# EAGLE schematic FMU_V.2 (EAGLE 7.4.0)

## Sheet 1 of 10
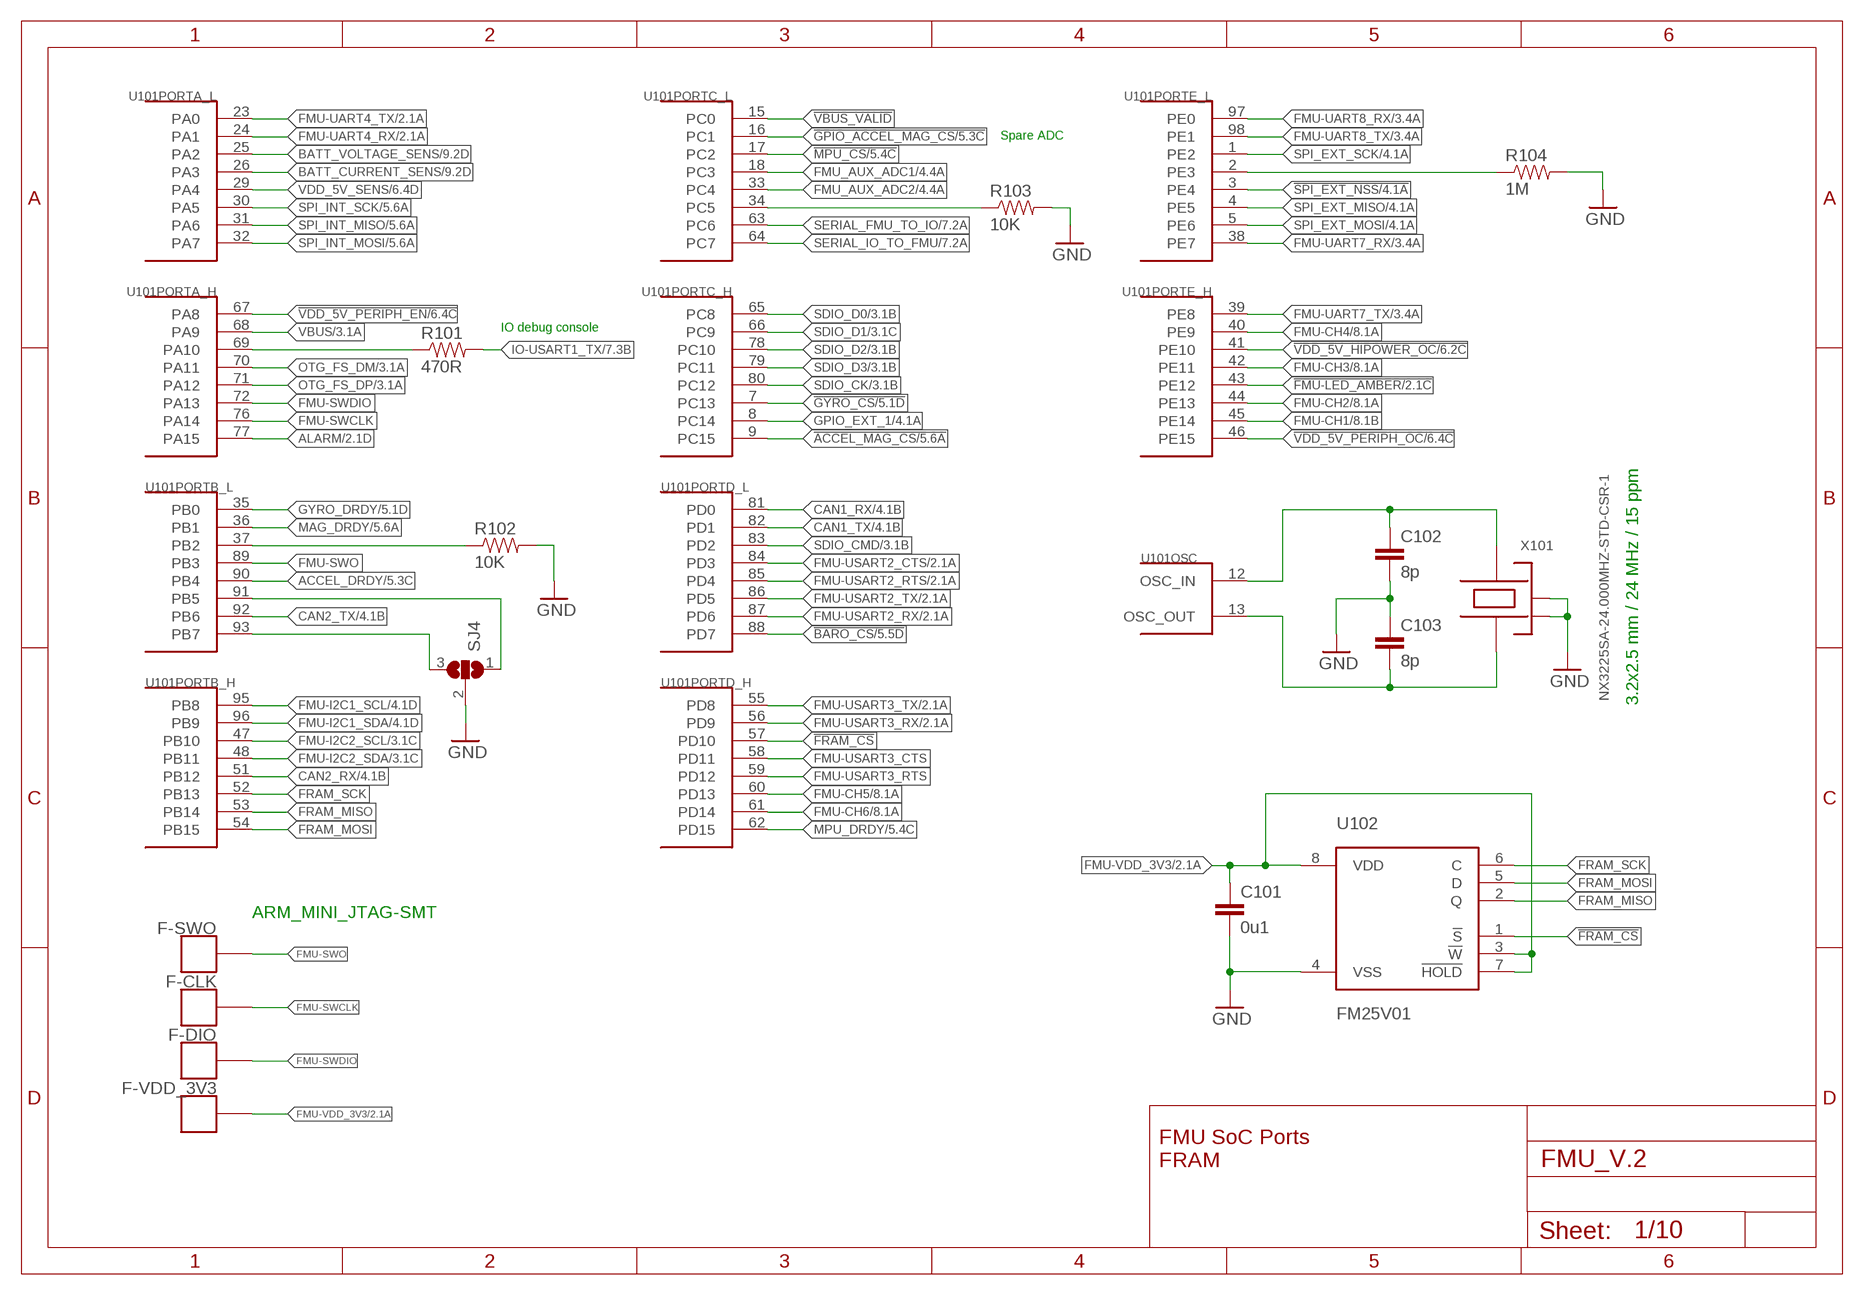
[diagram p0: schematic, sheet 1]

### Parts
C101  0u1  CAP0603  [0603-CAP]
C102  8p  CAP0603  [0603-CAP]
C103  8p  CAP0603  [0603-CAP]
F-CLK  PAD.04  [PAD.04X.04]
F-DIO  PAD.04  [PAD.04X.04]
F-SWO  PAD.04  [PAD.04X.04]
F-VDD_3V3  PAD.04  [PAD.04X.04]
R101  470R  RESISTOR0603-RES  [0603-RES]
R102  10K  RESISTOR0603-RES  [0603-RES]
R103  10K  RESISTOR0603-RES  [0603-RES]
R104  1M  RESISTOR0603-RES  [0603-RES]
SJ4  SJ2W  [SJ_2]
U101  STM32F4X7VX  [TQFP100]
U102  FM25V01  [SO08]
X101  NX3225SA-24.000MHZ-STD-CSR-1  OSCILLATOR-3.2X2.5  [OSCILLATOR-3.2X2.5]

### Nets
!ACCEL_MAG_CS: U101.9(PORTC_H:PC15) ; also sheet 5
!BARO_CS: U101.88(PORTD_L:PD7) ; also sheet 5
!FMU-LED_AMBER: U101.43(PORTE_H:PE12) ; also sheet 2
!FRAM_CS: U101.57(PORTD_H:PD10) U102.1(!S)
!GPIO_ACCEL_MAG_CS: U101.16(PORTC_L:PC1) ; also sheet 5
!GYRO_CS: U101.7(PORTC_H:PC13) ; also sheet 5
!MPU_CS: U101.17(PORTC_L:PC2) ; also sheet 5
!SPI_EXT_NSS: U101.3(PORTE_L:PE4) ; also sheet 4
!VBUS_VALID: U101.15(PORTC_L:PC0)
!VDD_5V_HIPOWER_OC: U101.41(PORTE_H:PE10) ; also sheet 6
!VDD_5V_PERIPH_EN: U101.67(PORTA_H:PA8) ; also sheet 6
!VDD_5V_PERIPH_OC: U101.46(PORTE_H:PE15) ; also sheet 6
!VDD_BRICK_VALID: SJ4.1 U101.91(PORTB_L:PB5)
!VDD_SERVO_VALID: SJ4.3 U101.93(PORTB_L:PB7)
ACCEL_DRDY: U101.90(PORTB_L:PB4) ; also sheet 5
ALARM: U101.77(PORTA_H:PA15) ; also sheet 2
BATT_CURRENT_SENS: U101.26(PORTA_L:PA3) ; also sheet 9
BATT_VOLTAGE_SENS: U101.25(PORTA_L:PA2) ; also sheet 9
CAN1_RX: U101.81(PORTD_L:PD0) ; also sheet 4
CAN1_TX: U101.82(PORTD_L:PD1) ; also sheet 4
CAN2_RX: U101.51(PORTB_H:PB12) ; also sheet 4
CAN2_TX: U101.92(PORTB_L:PB6) ; also sheet 4
FMU-CH1: U101.45(PORTE_H:PE14) ; also sheet 8
FMU-CH2: U101.44(PORTE_H:PE13) ; also sheet 8
FMU-CH3: U101.42(PORTE_H:PE11) ; also sheet 8
FMU-CH4: U101.40(PORTE_H:PE9) ; also sheet 8
FMU-CH5: U101.60(PORTD_H:PD13) ; also sheet 8
FMU-CH6: U101.61(PORTD_H:PD14) ; also sheet 8
FMU-I2C1_SCL: U101.95(PORTB_H:PB8) ; also sheet 4
FMU-I2C1_SDA: U101.96(PORTB_H:PB9) ; also sheet 4
FMU-I2C2_SCL: U101.47(PORTB_H:PB10) ; also sheet 3
FMU-I2C2_SDA: U101.48(PORTB_H:PB11) ; also sheet 3
FMU-SWCLK: F-CLK.P$1 U101.76(PORTA_H:PA14)
FMU-SWDIO: F-DIO.P$1 U101.72(PORTA_H:PA13)
FMU-SWO: F-SWO.P$1 U101.89(PORTB_L:PB3)
FMU-UART4_RX: U101.24(PORTA_L:PA1) ; also sheet 2
FMU-UART4_TX: U101.23(PORTA_L:PA0) ; also sheet 2
FMU-UART7_RX: U101.38(PORTE_L:PE7) ; also sheet 3
FMU-UART7_TX: U101.39(PORTE_H:PE8) ; also sheet 3
FMU-UART8_RX: U101.97(PORTE_L:PE0) ; also sheet 3
FMU-UART8_TX: U101.98(PORTE_L:PE1) ; also sheet 3
FMU-USART2_CTS: U101.84(PORTD_L:PD3) ; also sheet 2
FMU-USART2_RTS: U101.85(PORTD_L:PD4) ; also sheet 2
FMU-USART2_RX: U101.87(PORTD_L:PD6) ; also sheet 2
FMU-USART2_TX: U101.86(PORTD_L:PD5) ; also sheet 2
FMU-USART3_CTS: U101.58(PORTD_H:PD11)
FMU-USART3_RTS: U101.59(PORTD_H:PD12)
FMU-USART3_RX: U101.56(PORTD_H:PD9) ; also sheet 2
FMU-USART3_TX: U101.55(PORTD_H:PD8) ; also sheet 2
FMU-VDD_3V3 [power]: C101.P$1 F-VDD_3V3.P$1 U102.3(!W) U102.7(!HOLD) U102.8(VDD) ; also sheet 2,3,4,6,8
FMU_AUX_ADC1: U101.18(PORTC_L:PC3) ; also sheet 4
FMU_AUX_ADC2: U101.33(PORTC_L:PC4) ; also sheet 4
FRAM_MISO: U101.53(PORTB_H:PB14) U102.2(Q)
FRAM_MOSI: U101.54(PORTB_H:PB15) U102.5(D)
FRAM_SCK: U101.52(PORTB_H:PB13) U102.6(C)
GND [power]: C101.P$2 C102.P$2 C103.P$1 R102.2 R103.2 R104.2 SJ4.2 U102.4(VSS) X101.2(NC_2) X101.4(NC_4) ; also sheet 2,3,4,5,6,7,8,9,10
GPIO_EXT_1: U101.8(PORTC_H:PC14) ; also sheet 4
GYRO_DRDY: U101.35(PORTB_L:PB0) ; also sheet 5
IO-USART1_TX: R101.2 ; also sheet 7
MAG_DRDY: U101.36(PORTB_L:PB1) ; also sheet 5
MPU_DRDY [power]: U101.62(PORTD_H:PD15) ; also sheet 5
N$1: C103.P$2 U101.13(OSC:OSC_OUT) X101.1
N$2: C102.P$1 U101.12(OSC:OSC_IN) X101.3
N$14 [power]: R104.1 U101.2(PORTE_L:PE3)
N$16: R103.1 U101.34(PORTC_L:PC5)
N$23: R101.1 U101.69(PORTA_H:PA10)
OTG_FS_DM: U101.70(PORTA_H:PA11) ; also sheet 3,10
OTG_FS_DP: U101.71(PORTA_H:PA12) ; also sheet 3,10
PC5: R102.1 U101.37(PORTB_L:PB2)
SDIO_CK: U101.80(PORTC_H:PC12) ; also sheet 3
SDIO_CMD: U101.83(PORTD_L:PD2) ; also sheet 3
SDIO_D0: U101.65(PORTC_H:PC8) ; also sheet 3
SDIO_D1: U101.66(PORTC_H:PC9) ; also sheet 3
SDIO_D2: U101.78(PORTC_H:PC10) ; also sheet 3
SDIO_D3: U101.79(PORTC_H:PC11) ; also sheet 3
SERIAL_FMU_TO_IO: U101.63(PORTC_L:PC6) ; also sheet 7
SERIAL_IO_TO_FMU: U101.64(PORTC_L:PC7) ; also sheet 7
SPI_EXT_MISO: U101.4(PORTE_L:PE5) ; also sheet 4
SPI_EXT_MOSI: U101.5(PORTE_L:PE6) ; also sheet 4
SPI_EXT_SCK: U101.1(PORTE_L:PE2) ; also sheet 4
SPI_INT_MISO: U101.31(PORTA_L:PA6) ; also sheet 5
SPI_INT_MOSI: U101.32(PORTA_L:PA7) ; also sheet 5
SPI_INT_SCK: U101.30(PORTA_L:PA5) ; also sheet 5
VBUS [power]: U101.68(PORTA_H:PA9) ; also sheet 3
VDD_5V_SENS: U101.29(PORTA_L:PA4) ; also sheet 6

### Notes on the sheet
- Spare ADC
- IO debug console
- 3.2x2.5 mm / 24 MHz / 15 ppm
- ARM_MINI_JTAG-SMT
- FMU SoC Ports
  FRAM

## Sheet 2 of 10
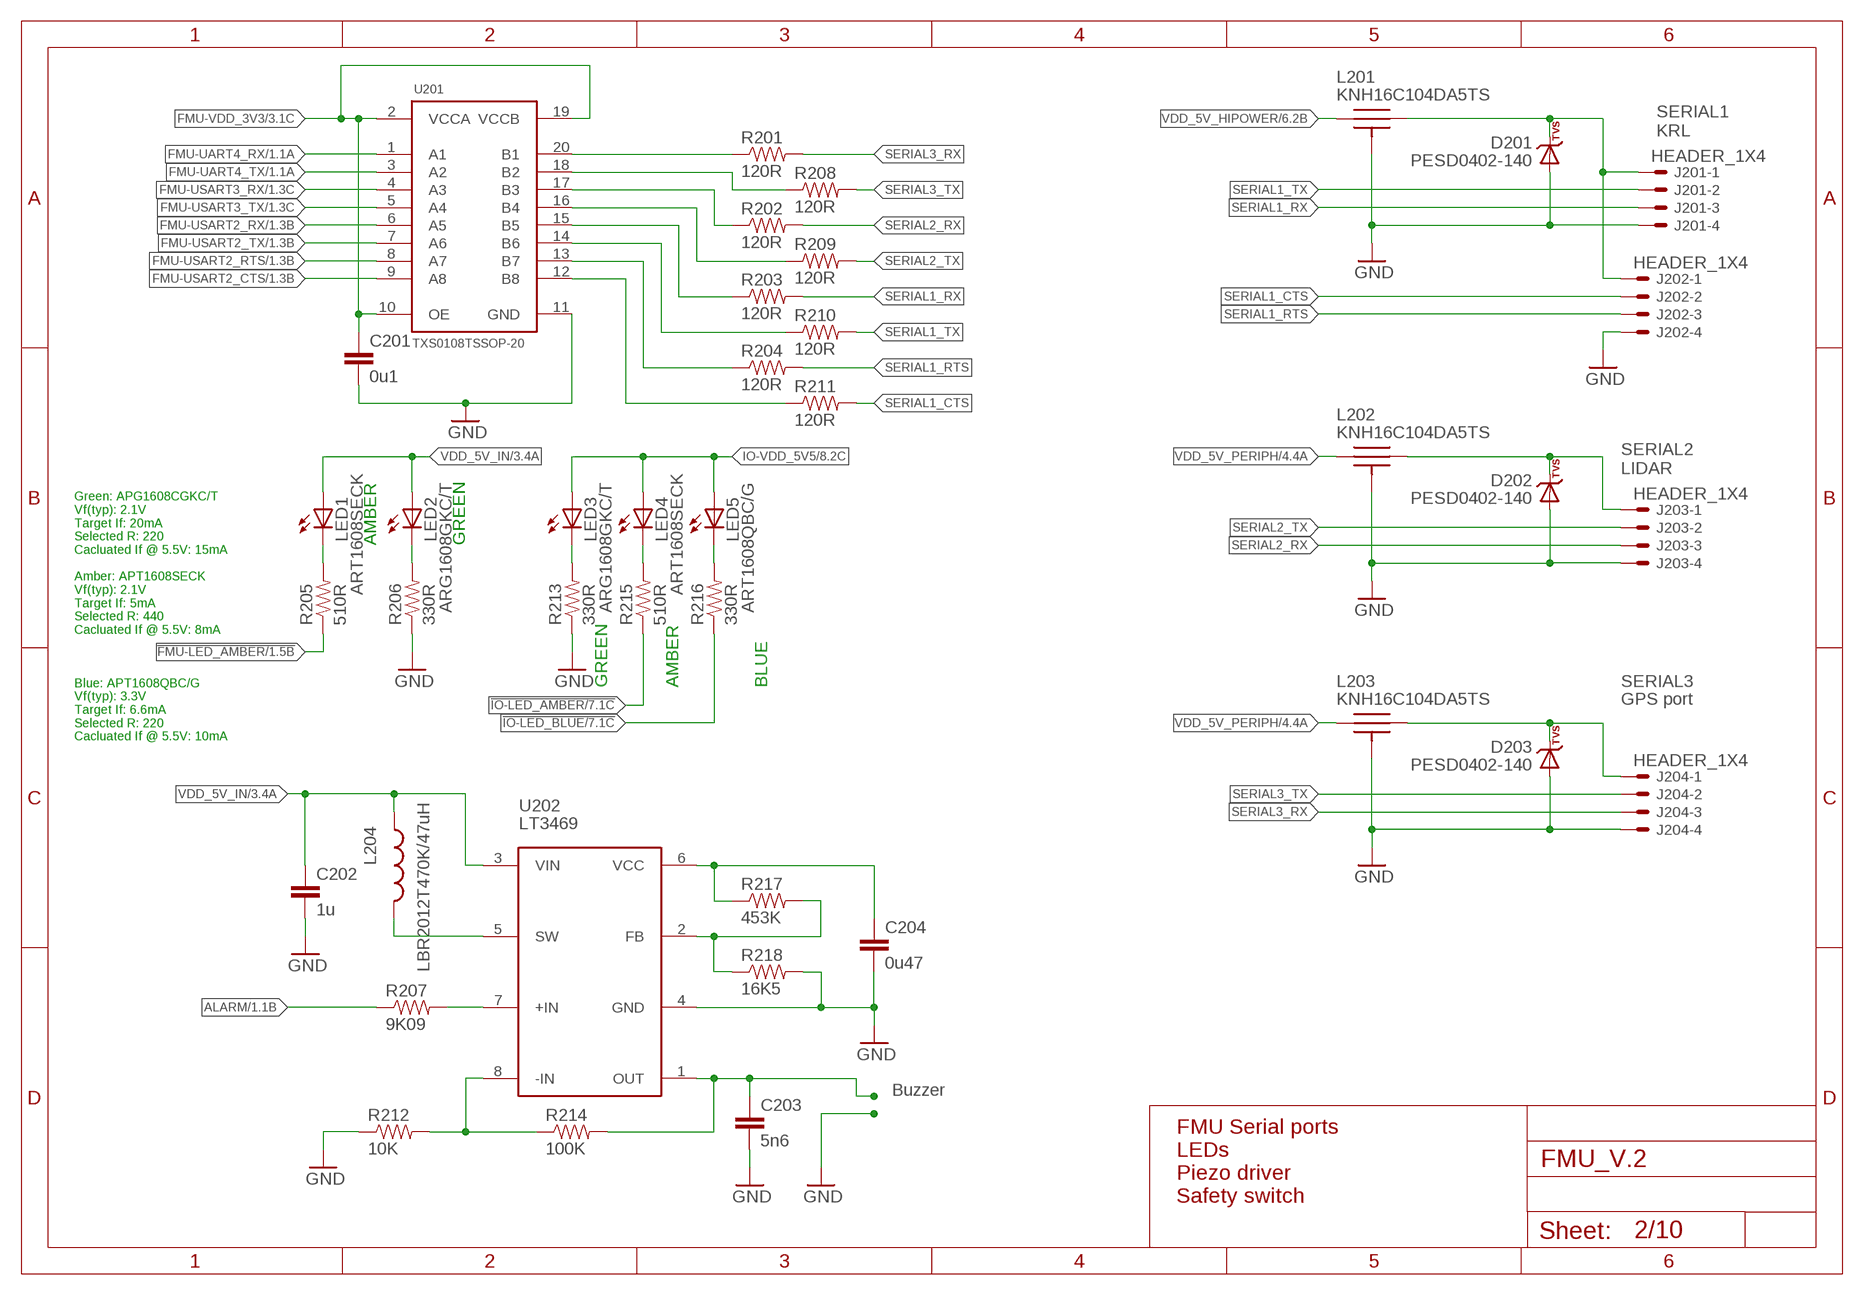
[diagram p1: schematic, sheet 2]

### Parts
C201  0u1  CAP0603  [0603-CAP]
C202  1u  CAP0603  [0603-CAP]
C203  5n6  CAP0603  [0603-CAP]
C204  0u47  CAP0603  [0603-CAP]
D201  PESD0402-140  DIODE-TVS  [0402-TVS]
D202  PESD0402-140  DIODE-TVS  [0402-TVS]
D203  PESD0402-140  DIODE-TVS  [0402-TVS]
J201  HEADER_1X4  [HEADER_2.54MM-1X04]
J202  HEADER_1X4  [HEADER_2.54MM-1X04]
J203  HEADER_1X4  [HEADER_2.54MM-1X04]
J204  HEADER_1X4  [HEADER_2.54MM-1X04]
L201  KNH16C104DA5TS  [KYOCERA-KNH16-DA]
L202  KNH16C104DA5TS  [KYOCERA-KNH16-DA]
L203  KNH16C104DA5TS  [KYOCERA-KNH16-DA]
L204  LBR2012T470K/47uH  INDUCTOR0805  [0805-IND]
LED1  ART1608SECK  LED0603  [0603-LED]
LED2  ARG1608GKC/T  LED0603  [0603-LED]
LED3  ARG1608GKC/T  LED0603  [0603-LED]
LED4  ART1608SECK  LED0603  [0603-LED]
LED5  ART1608QBC/G  LED0603  [0603-LED]
R201  120R  RESISTOR0603-RES  [0603-RES]
R202  120R  RESISTOR0603-RES  [0603-RES]
R203  120R  RESISTOR0603-RES  [0603-RES]
R204  120R  RESISTOR0603-RES  [0603-RES]
R205  510R  RESISTOR0603-RES  [0603-RES]
R206  330R  RESISTOR0603-RES  [0603-RES]
R207  9K09  RESISTOR0603-RES  [0603-RES]
R208  120R  RESISTOR0603-RES  [0603-RES]
R209  120R  RESISTOR0603-RES  [0603-RES]
R210  120R  RESISTOR0603-RES  [0603-RES]
R211  120R  RESISTOR0603-RES  [0603-RES]
R212  10K  RESISTOR0603-RES  [0603-RES]
R213  330R  RESISTOR0603-RES  [0603-RES]
R214  100K  RESISTOR0603-RES  [0603-RES]
R215  510R  RESISTOR0603-RES  [0603-RES]
R216  330R  RESISTOR0603-RES  [0603-RES]
R217  453K  RESISTOR0603-RES  [0603-RES]
R218  16K5  RESISTOR0603-RES  [0603-RES]
U201  TXS0108TSSOP-20  [R-PDSO-G20]
U202  LT3469  [SOT23-8]

### Nets
!FMU-LED_AMBER: R205.1 ; also sheet 1
!IO-LED_AMBER: R215.1 ; also sheet 7
!IO-LED_BLUE: R216.1 ; also sheet 7
ALARM: R207.1 ; also sheet 1
FMU-UART4_RX: U201.1(A1) ; also sheet 1
FMU-UART4_TX: U201.3(A2) ; also sheet 1
FMU-USART2_CTS: U201.9(A8) ; also sheet 1
FMU-USART2_RTS: U201.8(A7) ; also sheet 1
FMU-USART2_RX: U201.6(A5) ; also sheet 1
FMU-USART2_TX: U201.7(A6) ; also sheet 1
FMU-USART3_RX: U201.4(A3) ; also sheet 1
FMU-USART3_TX: U201.5(A4) ; also sheet 1
FMU-VDD_3V3 [power]: C201.P$1 U201.2(VCCA) U201.10(OE) U201.19(VCCB) ; also sheet 1,3,4,6,8
GND [power]: C201.P$2 C202.P$2 C203.P$2 C204.P$2 D201.A D202.A D203.A J201.4 J202.4 J203.4 J204.4 L201.P$3 L201.P$4 L201.P$5 L202.P$3 L202.P$4 L202.P$5 L203.P$3 L203.P$4 L203.P$5 R206.1 R212.1 R213.1 R218.2 U201.11(GND) U202.4(GND) ; also sheet 1,3,4,5,6,7,8,9,10
IO-VDD_5V5 [power]: LED3.A LED4.A LED5.A ; also sheet 8
N$5 [power]: D201.C J201.1 J202.1 L201.P$2
N$70: R201.1 U201.20(B1)
N$82: R208.1 U201.18(B2)
N$83: R202.1 U201.17(B3)
N$84: R209.1 U201.16(B4)
N$85: R203.1 U201.15(B5)
N$86: R210.1 U201.14(B6)
N$87: R204.1 U201.13(B7)
N$88: R211.1 U201.12(B8)
N$89: LED1.C R205.2
N$91: LED2.C R206.2
N$92: L204.P$2 U202.5(SW)
N$93: LED3.C R213.2
N$94: LED4.C R215.2
N$95: LED5.C R216.2
N$100 [power]: D203.C J204.1 L203.P$2
N$101 [power]: D202.C J203.1 L202.P$2
N$104: C203.P$1 R214.2 U202.1(OUT)
N$110: R207.2 U202.7(+IN)
N$132: R212.2 R214.1 U202.8(-IN)
N$134: C204.P$1 R217.1 U202.6(VCC)
N$135: R217.2 R218.1 U202.2(FB)
SERIAL1_CTS: J202.2 R211.2
SERIAL1_RTS: J202.3 R204.2
SERIAL1_RX: J201.3 R203.2
SERIAL1_TX: J201.2 R210.2
SERIAL2_RX: J203.3 R202.2
SERIAL2_TX: J203.2 R209.2
SERIAL3_RX: J204.3 R201.2
SERIAL3_TX: J204.2 R208.2
VDD_5V_HIPOWER [power]: L201.P$1 ; also sheet 6
VDD_5V_IN [power]: C202.P$1 L204.P$1 LED1.A LED2.A U202.3(VIN) ; also sheet 3,6,8,9,10
VDD_5V_PERIPH [power]: L202.P$1 L203.P$1 ; also sheet 4,6

### Notes on the sheet
- SERIAL1
  KRL
- SERIAL2
  LIDAR
- AMBER | GREEN
- GREEN | AMBER | BLUE | SERIAL3
- GPS port
- Green: APG1608CGKC/T
  Vf(typ): 2.1V
  Target If: 20mA
  Selected R: 220
  Cacluated If @ 5.5V: 15mA
  
  Amber: APT1608SECK
  Vf(typ): 2.1V
  Target If: 5mA
  Selected R: 440
  Cacluated If @ 5.5V: 8mA
  
  
  
  Blue: APT1608QBC/G
  Vf(typ): 3.3V
  Target If: 6.6mA
  Selected R: 220
  Cacluated If @ 5.5V: 10mA
- Buzzer
- FMU Serial ports
  LEDs
  Piezo driver
  Safety switch

## Sheet 3 of 10
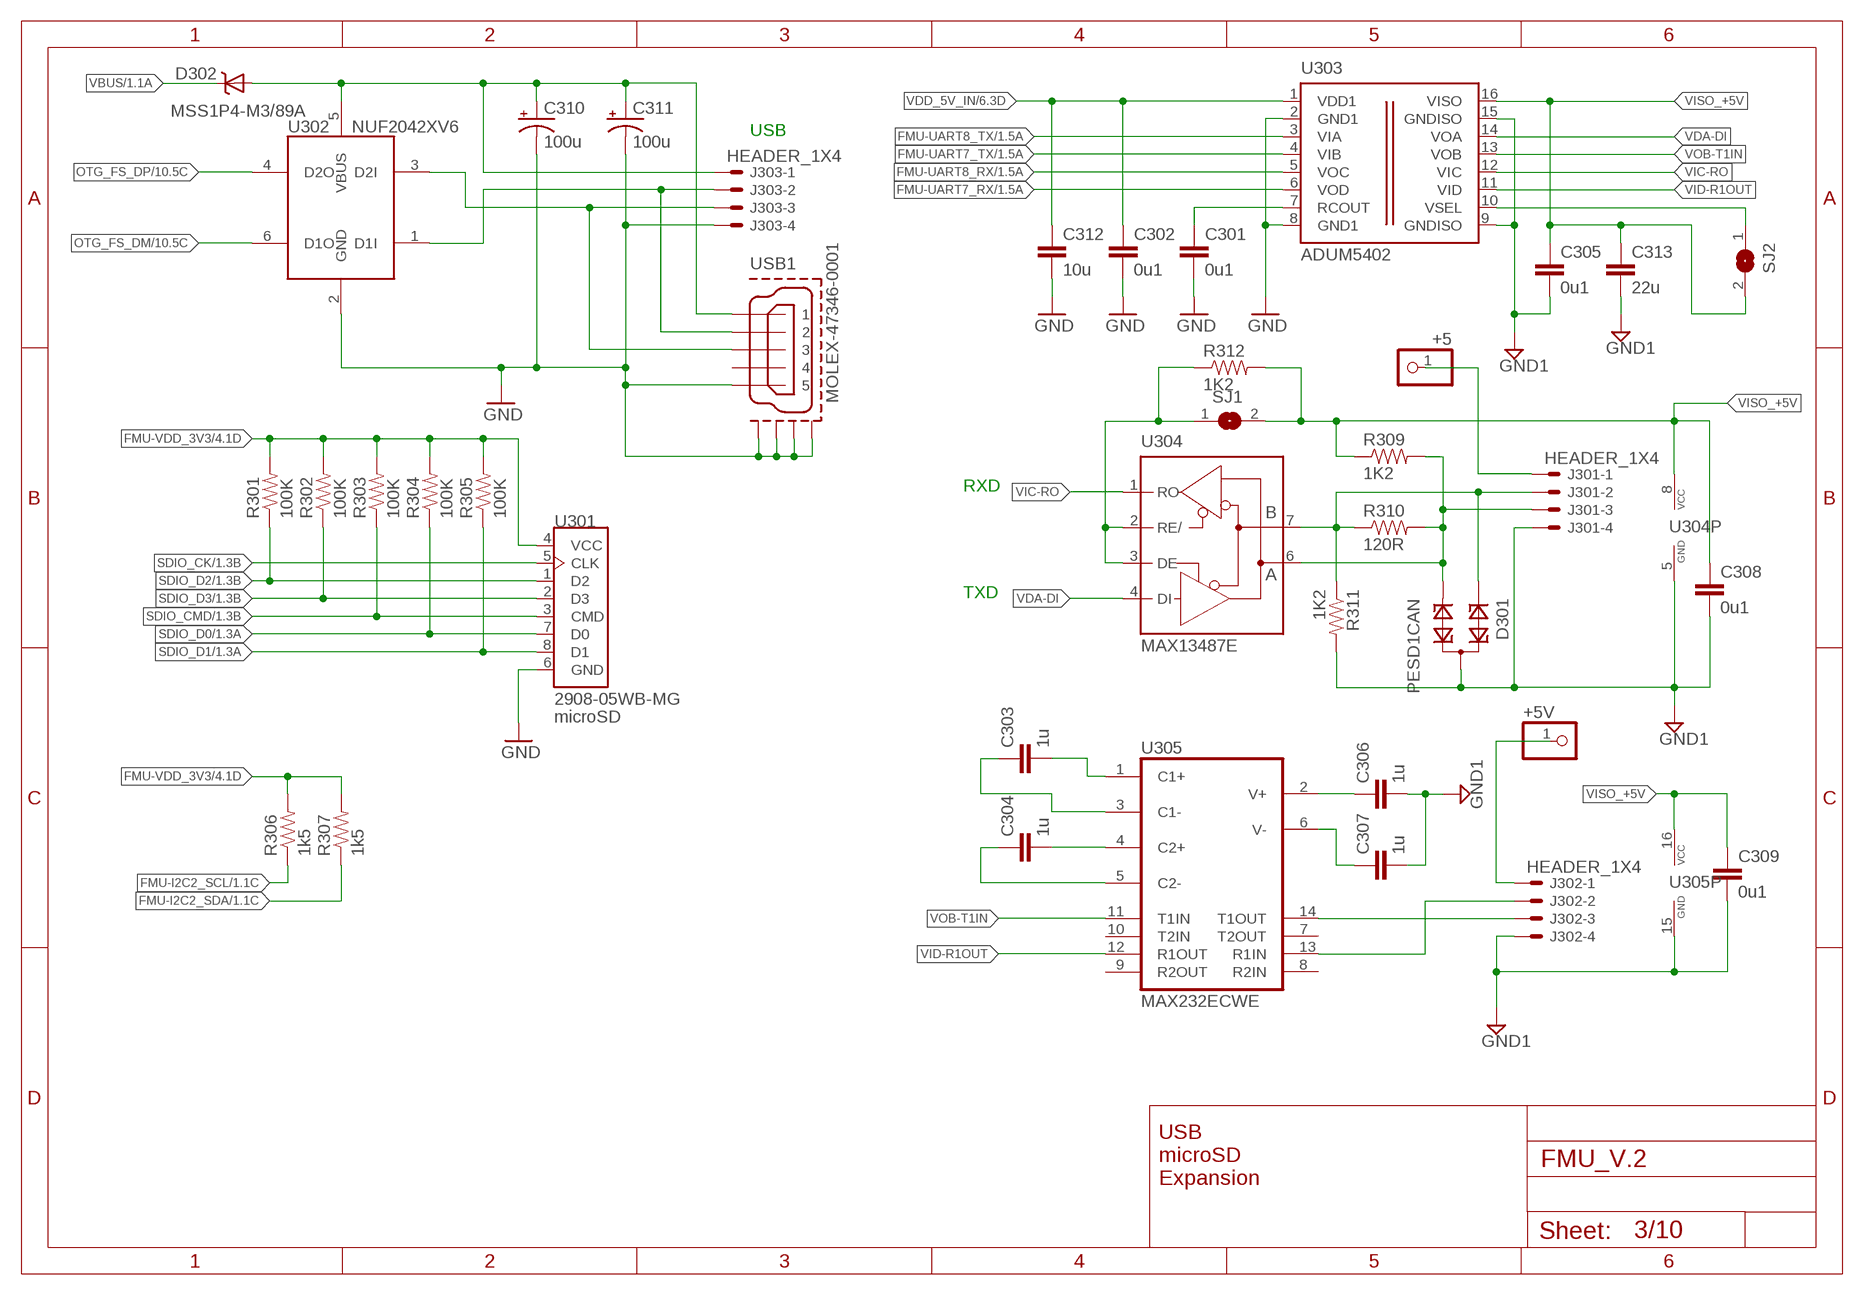
[diagram p2: schematic, sheet 3]

### Parts
+5  PINHD-1X1  [1X01]
+5V  PINHD-1X1  [1X01]
C301  0u1  CAP0603  [0603-CAP]
C302  0u1  CAP0603  [0603-CAP]
C303  1u  CAP0805  [0805-CAP]
C304  1u  CAP0805  [0805-CAP]
C305  0u1  CAP0603  [0603-CAP]
C306  1u  CAP0805  [0805-CAP]
C307  1u  CAP0805  [0805-CAP]
C308  0u1  CAP0603  [0603-CAP]
C309  0u1  CAP0603  [0603-CAP]
C310  100u  CAP_POL1206  [EIA3216]
C311  100u  CAP_POL1206  [EIA3216]
C312  10u  CAP0805  [0805-CAP]
C313  22u  CAP0805  [0805-CAP]
D301  PESD1CAN  [SOT23]
D302  MSS1P4-M3/89A  DIODE-SCHOTTKY_MSMP  [MICROSMP]
J301  HEADER_1X4  [HEADER_2.54MM-1X04]
J302  HEADER_1X4  [HEADER_2.54MM-1X04]
J303  HEADER_1X4  [HEADER_2.54MM-1X04]
R301  100K  RESISTOR0603-RES  [0603-RES]
R302  100K  RESISTOR0603-RES  [0603-RES]
R303  100K  RESISTOR0603-RES  [0603-RES]
R304  100K  RESISTOR0603-RES  [0603-RES]
R305  100K  RESISTOR0603-RES  [0603-RES]
R306  1k5  RESISTOR0603-RES  [0603-RES]
R307  1k5  RESISTOR0603-RES  [0603-RES]
R309  1K2  RESISTOR0603-RES  [0603-RES]
R310  120R  RESISTOR0805  [0805]
R311  1K2  RESISTOR0603-RES  [0603-RES]
R312  1K2  RESISTOR0603-RES  [0603-RES]
SJ1  SJ  [SJ]
SJ2  SJ  [SJ]
U301  2908-05WB-MG  MICROSDSDI  [MICROSD]
U302  NUF2042XV6  [SOT563-6]
U303  ADUM5402  ADUM1301  [SO-16W]
U304  MAX13487E  MAX481CSA  [SO08]
U305  MAX232ECWE  [SO16L]
USB1  MOLEX-47346-0001  [MOLEX-47346-0001]

### Nets
1: C310.A(+) C311.A(+) D302.ANODE(A) J303.1 U302.5(VBUS) USB1.VBUS
FMU-I2C2_SCL: R306.1 ; also sheet 1
FMU-I2C2_SDA: R307.1 ; also sheet 1
FMU-UART7_RX: U303.6(VOD) ; also sheet 1
FMU-UART7_TX: U303.4(VIB) ; also sheet 1
FMU-UART8_RX: U303.5(VOC) ; also sheet 1
FMU-UART8_TX: U303.3(VIA) ; also sheet 1
FMU-VDD_3V3 [power]: R301.2 R302.2 R303.2 R304.2 R305.2 R306.2 R307.2 U301.4(VCC) ; also sheet 1,2,4,6,8
GND [power]: C301.P$2 C302.P$2 C310.C(-) C311.C(-) C312.P$2 J303.4 U301.6(GND) U302.2(GND) U303.2(GND1) U303.8(GND1) USB1.GND USB1.GND1 USB1.GND2 USB1.GND3 USB1.GND4 ; also sheet 1,2,4,5,6,7,8,9,10
GND1 [power]: C305.P$2 C306.P$2 C307.P$2 C308.P$2 C309.P$2 C313.P$2 D301.3 J301.4 J302.4 R311.2 U303.9(GNDISO) U303.15(GNDISO) U304.5(GND) U305.15(GND) ; also sheet 4
N$17: SJ2.1 U303.10(VSEL)
N$43: C304.P$2 U305.4(C2+)
N$44: C304.P$1 U305.5(C2-)
N$46: C303.P$1 U305.3(C1-)
N$49: R312.1 SJ1.1 U304.2(RE/) U304.3(DE)
N$53: C301.P$1 U303.7(RCOUT)
N$57: C303.P$2 U305.1(C1+)
N$58: C306.P$1 U305.2(V+)
N$59: D301.1 J301.2 R310.1 R311.1 U304.7(B)
N$60: D301.2 J301.3 R309.2 R310.2 U304.6(A)
N$68: C307.P$1 U305.6(V-)
N$73: J302.3 U305.14(T1OUT)
N$74: J302.2 U305.13(R1IN)
N$77: +5.1 J301.1
N$78: +5V.1 J302.1
OTG_DM1: J303.2 U302.1(D1I) USB1.D-
OTG_DP1: J303.3 U302.3(D2I) USB1.D+
OTG_FS_DM: U302.6(D1O) ; also sheet 1,10
OTG_FS_DP: U302.4(D2O) ; also sheet 1,10
SDIO_CK: U301.5(CLK) ; also sheet 1
SDIO_CMD: R303.1 U301.3(CMD) ; also sheet 1
SDIO_D0: R304.1 U301.7(D0) ; also sheet 1
SDIO_D1: R305.1 U301.8(D1) ; also sheet 1
SDIO_D2: R301.1 U301.1(D2) ; also sheet 1
SDIO_D3: R302.1 U301.2(D3) ; also sheet 1
VBUS [power]: D302.CATHODE(C) ; also sheet 1
VDA-DI: U303.14(VOA) U304.4(DI)
VDD_5V_IN [power]: C302.P$1 C312.P$1 U303.1(VDD1) ; also sheet 2,6,8,9,10
VIC-RO: U303.12(VIC) U304.1(RO)
VID-R1OUT: U303.11(VID) U305.12(R1OUT)
VISO_+5V: C305.P$1 C308.P$1 C309.P$1 C313.P$1 R309.1 R312.2 SJ1.2 SJ2.2 U303.16(VISO) U304.8(VCC) U305.16(VCC)
VOB-T1IN: U303.13(VOB) U305.11(T1IN)
Unconnected: U305.7(T2OUT) U305.8(R2IN) U305.9(R2OUT) U305.10(T2IN) USB1.ID

### Notes on the sheet
- USB
- RXD
- TXD
- microSD
- USB
  microSD
  Expansion

## Sheet 4 of 10
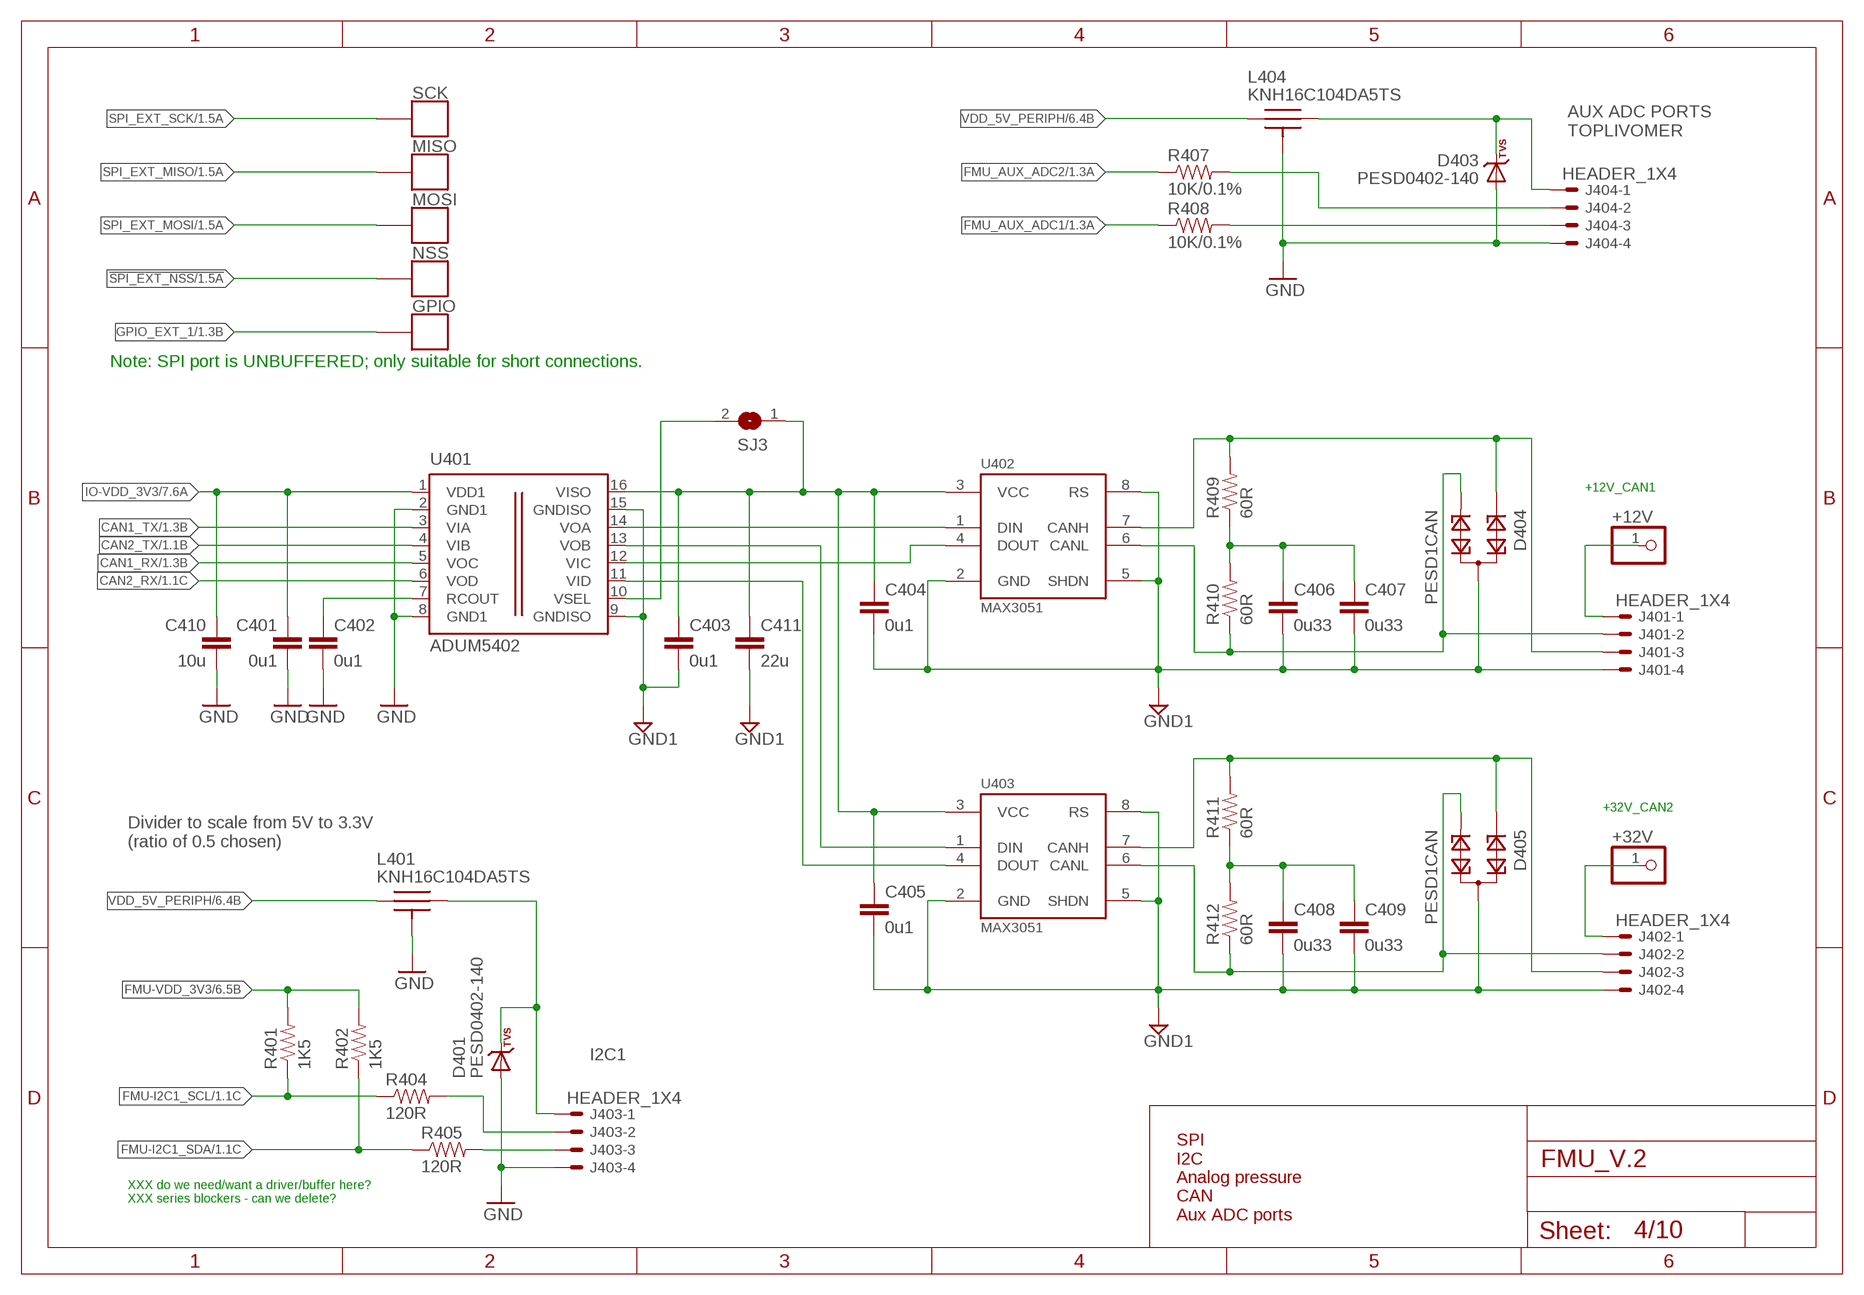
[diagram p3: schematic, sheet 4]

### Parts
+12V  PINHD-1X1  [1X01]
+32V  PINHD-1X1  [1X01]
C401  0u1  CAP0603  [0603-CAP]
C402  0u1  CAP0603  [0603-CAP]
C403  0u1  CAP0603  [0603-CAP]
C404  0u1  CAP0603  [0603-CAP]
C405  0u1  CAP0603  [0603-CAP]
C406  0u33  CAP1210  [1210]
C407  0u33  CAP1210  [1210]
C408  0u33  CAP1210  [1210]
C409  0u33  CAP1210  [1210]
C410  10u  CAP0805  [0805-CAP]
C411  22u  CAP0805  [0805-CAP]
D401  PESD0402-140  DIODE-TVS  [0402-TVS]
D403  PESD0402-140  DIODE-TVS  [0402-TVS]
D404  PESD1CAN  [SOT23]
D405  PESD1CAN  [SOT23]
GPIO  PAD.04  [PAD.04X.04]
J401  HEADER_1X4  [HEADER_2.54MM-1X04]
J402  HEADER_1X4  [HEADER_2.54MM-1X04]
J403  HEADER_1X4  [HEADER_2.54MM-1X04]
J404  HEADER_1X4  [HEADER_2.54MM-1X04]
L401  KNH16C104DA5TS  [KYOCERA-KNH16-DA]
L404  KNH16C104DA5TS  [KYOCERA-KNH16-DA]
MISO  PAD.04  [PAD.04X.04]
MOSI  PAD.04  [PAD.04X.04]
NSS  PAD.04  [PAD.04X.04]
R401  1K5  RESISTOR0603-RES  [0603-RES]
R402  1K5  RESISTOR0603-RES  [0603-RES]
R404  120R  RESISTOR0603-RES  [0603-RES]
R405  120R  RESISTOR0603-RES  [0603-RES]
R407  10K/0.1%  RESISTOR0603-RES  [0603-RES]
R408  10K/0.1%  RESISTOR0603-RES  [0603-RES]
R409  60R  RESISTOR0805  [0805]
R410  60R  RESISTOR0805  [0805]
R411  60R  RESISTOR0805  [0805]
R412  60R  RESISTOR0805  [0805]
SCK  PAD.04  [PAD.04X.04]
SJ3  SJ  [SJ]
U401  ADUM5402  ADUM1301  [SO-16W]
U402  MAX3051  MAX3051MAX3051EKA  [SOT23-8]
U403  MAX3051  MAX3051MAX3051EKA  [SOT23-8]

### Nets
!SPI_EXT_NSS: NSS.P$1 ; also sheet 1
CAN1_RX: U401.5(VOC) ; also sheet 1
CAN1_TX: U401.3(VIA) ; also sheet 1
CAN2_RX: U401.6(VOD) ; also sheet 1
CAN2_TX: U401.4(VIB) ; also sheet 1
FMU-I2C1_SCL: R401.1 R404.1 ; also sheet 1
FMU-I2C1_SDA: R402.1 R405.1 ; also sheet 1
FMU-VDD_3V3 [power]: R401.2 R402.2 ; also sheet 1,2,3,6,8
FMU_AUX_ADC1: R408.1 ; also sheet 1
FMU_AUX_ADC2: R407.1 ; also sheet 1
FMU_AUX_ADC2_PROT: J404.2 R407.2
GND [power]: C401.P$2 C402.P$2 C410.P$2 D401.A D403.A J403.4 J404.4 L401.P$3 L401.P$4 L401.P$5 L404.P$3 L404.P$4 L404.P$5 U401.2(GND1) U401.8(GND1) ; also sheet 1,2,3,5,6,7,8,9,10
GND1 [power]: C403.P$2 C404.P$2 C405.P$2 C406.2 C407.2 C408.2 C409.2 C411.P$2 D404.3 D405.3 J401.4 J402.4 U401.9(GNDISO) U401.15(GNDISO) U402.2(GND) U402.5(SHDN) U402.8(RS) U403.2(GND) U403.5(SHDN) U403.8(RS) ; also sheet 3
GPIO_EXT_1: GPIO.P$1 ; also sheet 1
IO-VDD_3V3 [power]: C401.P$1 C410.P$1 U401.1(VDD1) ; also sheet 7,8
N$4: J404.3 R408.2
N$7: C406.1 C407.1 R409.1 R410.2
N$9: D405.1 J402.3 R411.2 U403.7(CANH)
N$13: D404.1 J401.3 R409.2 U402.7(CANH)
N$19: SJ3.2 U401.10(VSEL)
N$20: U401.13(VOB) U403.1(DIN)
N$24: D405.2 J402.2 R412.1 U403.6(CANL)
N$25: D404.2 J401.2 R410.1 U402.6(CANL)
N$26: U401.14(VOA) U402.1(DIN)
N$28: U401.12(VIC) U402.4(DOUT)
N$31: U401.11(VID) U403.4(DOUT)
N$32: C402.P$1 U401.7(RCOUT)
N$33: J403.2 R404.2
N$36: C408.1 C409.1 R411.1 R412.2
N$37: J403.3 R405.2
N$38: C403.P$1 C404.P$1 C405.P$1 C411.P$1 SJ3.1 U401.16(VISO) U402.3(VCC) U403.3(VCC)
N$42 [power]: D401.C J403.1 L401.P$2
N$98 [power]: D403.C J404.1 L404.P$2
P1: +12V.1 J401.1
P2: +32V.1 J402.1
SPI_EXT_MISO: MISO.P$1 ; also sheet 1
SPI_EXT_MOSI: MOSI.P$1 ; also sheet 1
SPI_EXT_SCK: SCK.P$1 ; also sheet 1
VDD_5V_PERIPH [power]: L401.P$1 L404.P$1 ; also sheet 2,6

### Notes on the sheet
- AUX ADC PORTS
  TOPLIVOMER
- Note: SPI port is UNBUFFERED; only suitable for short connections.
- +12V_CAN1
- +32V_CAN2
- Divider to scale from 5V to 3.3V
  (ratio of 0.5 chosen)
- I2C1
- XXX do we need/want a driver/buffer here?
  XXX series blockers - can we delete?
- SPI
  I2C
  Analog pressure
  CAN
  Aux ADC ports

## Sheet 5 of 10
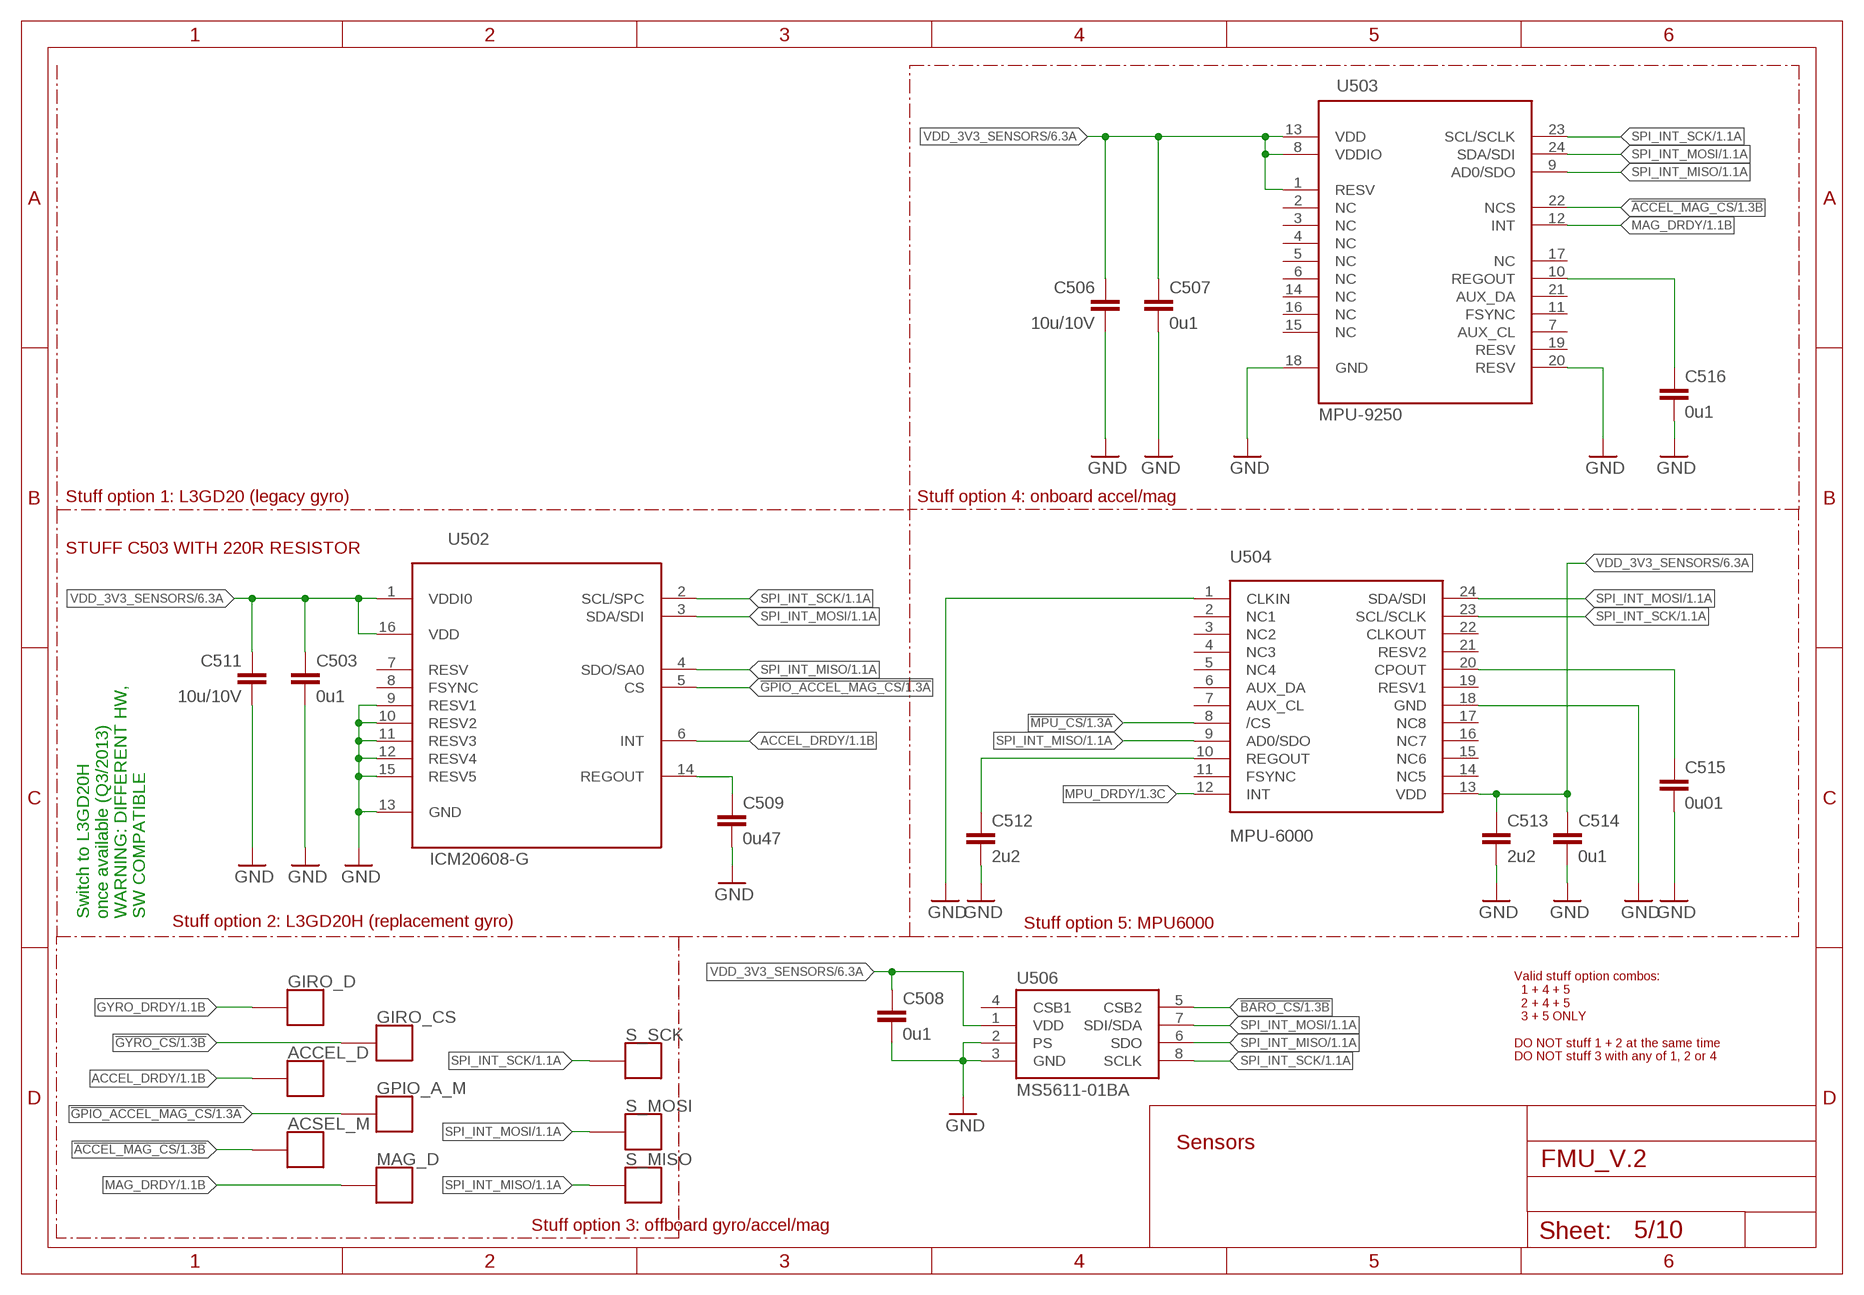
[diagram p4: schematic, sheet 5]

### Parts
ACCEL_D  PAD.04  [PAD.04X.04]
ACSEL_M  PAD.04  [PAD.04X.04]
C503  0u1  CAP0603  [0603-CAP]
C506  10u/10V  CAP0805  [0805-CAP]
C507  0u1  CAP0603  [0603-CAP]
C508  0u1  CAP0603  [0603-CAP]
C509  0u47  CAP0603  [0603-CAP]
C511  10u/10V  CAP0805  [0805-CAP]
C512  2u2  CAP0603  [0603-CAP]
C513  2u2  CAP0603  [0603-CAP]
C514  0u1  CAP0603  [0603-CAP]
C515  0u01  CAP0603  [0603-CAP]
C516  0u1  CAP0603  [0603-CAP]
GIRO_CS  PAD.04  [PAD.04X.04]
GIRO_D  PAD.04  [PAD.04X.04]
GPIO_A_M  PAD.04  [PAD.04X.04]
MAG_D  PAD.04  [PAD.04X.04]
S_MISO  PAD.04  [PAD.04X.04]
S_MOSI  PAD.04  [PAD.04X.04]
S_SCK  PAD.04  [PAD.04X.04]
U502  ICM20608-G  ICM20609ICM20609  [LGA-16-3PX5P]
U503  MPU-9250  [QFN]
U504  MPU-6000  [QFN-24]
U506  MS5611-01BA  [MS5611-01BA]

### Nets
!ACCEL_MAG_CS: ACSEL_M.P$1 U503.22(NCS) ; also sheet 1
!BARO_CS: U506.5(CSB2) ; also sheet 1
!GPIO_ACCEL_MAG_CS: GPIO_A_M.P$1 U502.5(CS) ; also sheet 1
!GYRO_CS: GIRO_CS.P$1 ; also sheet 1
!MPU_CS: U504.8(/CS) ; also sheet 1
ACCEL_DRDY: ACCEL_D.P$1 U502.6(INT) ; also sheet 1
GND [power]: C503.P$2 C506.P$2 C507.P$2 C508.P$2 C509.P$2 C511.P$2 C512.P$2 C513.P$2 C514.P$2 C515.P$2 C516.P$2 U502.9(RESV1) U502.10(RESV2) U502.11(RESV3) U502.12(RESV4) U502.13(GND) U502.15(RESV5) U503.18(GND) U503.20(RESV) U504.1(CLKIN) U504.18(GND) U506.2(PS) U506.3(GND) ; also sheet 1,2,3,4,6,7,8,9,10
GYRO_DRDY: GIRO_D.P$1 ; also sheet 1
MAG_DRDY: MAG_D.P$1 U503.12(INT) ; also sheet 1
MPU_DRDY [power]: U504.12(INT) ; also sheet 1
N$6: C509.P$1 U502.14(REGOUT)
N$10: C516.P$1 U503.10(REGOUT)
N$50: C512.P$1 U504.10(REGOUT)
N$51: C515.P$1 U504.20(CPOUT)
SPI_INT_MISO: S_MISO.P$1 U502.4(SDO/SA0) U503.9(AD0/SDO) U504.9(AD0/SDO) U506.6(SDO) ; also sheet 1
SPI_INT_MOSI: S_MOSI.P$1 U502.3(SDA/SDI) U503.24(SDA/SDI) U504.24(SDA/SDI) U506.7(SDI/SDA) ; also sheet 1
SPI_INT_SCK: S_SCK.P$1 U502.2(SCL/SPC) U503.23(SCL/SCLK) U504.23(SCL/SCLK) U506.8(SCLK) ; also sheet 1
VDD_3V3_SENSORS [power]: C503.P$1 C506.P$1 C507.P$1 C508.P$1 C511.P$1 C513.P$1 C514.P$1 U502.1(VDDI0) U502.16(VDD) U503.1(RESV) U503.8(VDDIO) U503.13(VDD) U504.13(VDD) U506.1(VDD) ; also sheet 6,10
Unconnected: U502.7(RESV) U502.8(FSYNC) U503.2(NC) U503.3(NC) U503.4(NC) U503.5(NC) U503.6(NC) U503.7(AUX_CL) U503.11(FSYNC) U503.14(NC) U503.15(NC) U503.16(NC) U503.17(NC) U503.19(RESV) U503.21(AUX_DA) U504.2(NC1) U504.3(NC2) U504.4(NC3) U504.5(NC4) U504.6(AUX_DA) U504.7(AUX_CL) U504.11(FSYNC) U504.14(NC5) U504.15(NC6) U504.16(NC7) U504.17(NC8) U504.19(RESV1) U504.21(RESV2) U504.22(CLKOUT) U506.4(CSB1)

### Notes on the sheet
- Stuff option 1: L3GD20 (legacy gyro) | Stuff option 4: onboard accel/mag
- STUFF C503 WITH 220R RESISTOR
- Switch to L3GD20H
  once available (Q3/2013)
  WARNING: DIFFERENT HW,
  SW COMPATIBLE
- Stuff option 2: L3GD20H (replacement gyro) | Stuff option 5: MPU6000
- Valid stuff option combos:
    1 + 4 + 5
    2 + 4 + 5
    3 + 5 ONLY
  
  DO NOT stuff 1 + 2 at the same time
  DO NOT stuff 3 with any of 1, 2 or 4
- Sensors
- Stuff option 3: offboard gyro/accel/mag

## Sheet 6 of 10
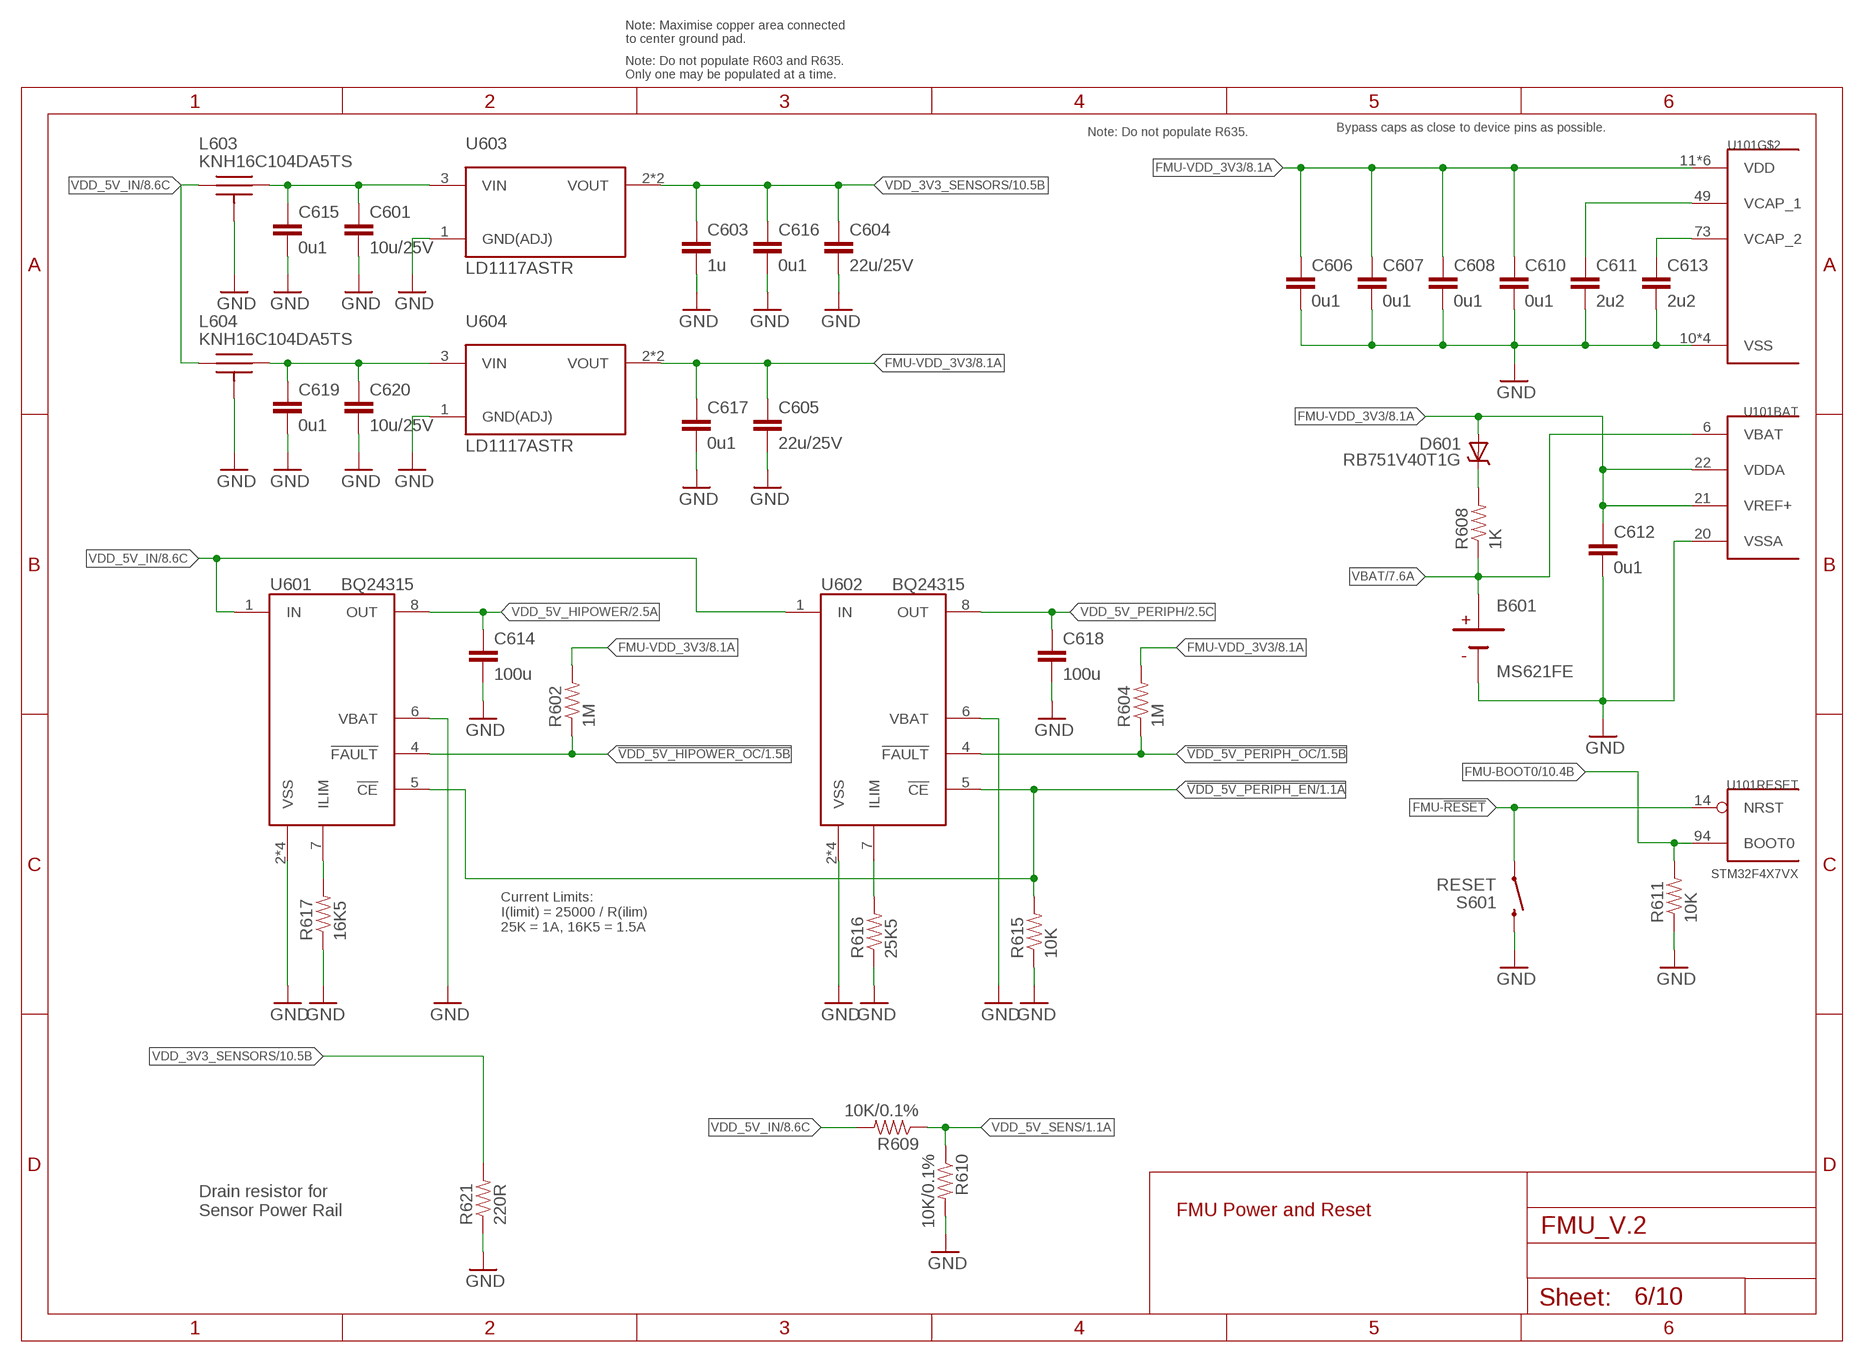
[diagram p5: schematic, sheet 6]

### Parts
B601  MS621FE  [MS621FE]
C601  10u/25V  CAP0805  [0805-CAP]
C603  1u  CAP0603  [0603-CAP]
C604  22u/25V  CAP0805  [0805-CAP]
C605  22u/25V  CAP0805  [0805-CAP]
C606  0u1  CAP0603  [0603-CAP]
C607  0u1  CAP0603  [0603-CAP]
C608  0u1  CAP0603  [0603-CAP]
C610  0u1  CAP0603  [0603-CAP]
C611  2u2  CAP0603  [0603-CAP]
C612  0u1  CAP0603  [0603-CAP]
C613  2u2  CAP0603  [0603-CAP]
C614  100u  CAP1206  [1206-CAP]
C615  0u1  CAP0603  [0603-CAP]
C616  0u1  CAP0603  [0603-CAP]
C617  0u1  CAP0603  [0603-CAP]
C618  100u  CAP1206  [1206-CAP]
C619  0u1  CAP0603  [0603-CAP]
C620  10u/25V  CAP0805  [0805-CAP]
D601  RB751V40T1G  DIODE-SCHOTTKY_SOD323  [SOD323]
L603  KNH16C104DA5TS  [KYOCERA-KNH16-DA]
L604  KNH16C104DA5TS  [KYOCERA-KNH16-DA]
R602  1M  RESISTOR0603-RES  [0603-RES]
R604  1M  RESISTOR0603-RES  [0603-RES]
R608  1K  RESISTOR0603-RES  [0603-RES]
R609  10K/0.1%  RESISTOR0603-RES  [0603-RES]
R610  10K/0.1%  RESISTOR0603-RES  [0603-RES]
R611  10K  RESISTOR0603-RES  [0603-RES]
R615  10K  RESISTOR0603-RES  [0603-RES]
R616  25K5  RESISTOR0603-RES  [0603-RES]
R617  16K5  RESISTOR0603-RES  [0603-RES]
R621  220R  RESISTOR0603-RES  [0603-RES]
S601  RESET  SWITCH-MOMENTARY-2  [EVQP7J01K]
U601  BQ24315  [QFN8-DSG]
U602  BQ24315  [QFN8-DSG]
U603  LD1117ASTR  [SOT-223]
U604  LD1117ASTR  [SOT-223]

### Nets
!VDD_5V_HIPOWER_OC: R602.1 U601.4(!FAULT) ; also sheet 1
!VDD_5V_PERIPH_EN: R615.2 U601.5(!CE) U602.5(!CE) ; also sheet 1
!VDD_5V_PERIPH_OC: R604.1 U602.4(!FAULT) ; also sheet 1
FMU-!RESET: S601.A1 U101.14(RESET:NRST)
FMU-BOOT0: R611.2 U101.94(RESET:BOOT0) ; also sheet 10
FMU-VDD_3V3 [power]: C605.P$1 C606.P$1 C607.P$1 C608.P$1 C610.P$1 C612.P$1 C617.P$1 D601.A R602.2 R604.2 U101.11(VDD) U101.19(VDD) U101.21(BAT:VREF+) U101.22(BAT:VDDA) U101.28(VDD) U101.50(VDD) U101.75(VDD) U101.100(VDD) U604.2(VOUT) U604.4(VOUT) ; also sheet 1,2,3,4,8
FMU-VDD_5V5 [power]: C601.P$1 C615.P$1 L603.P$2 U603.3(VIN)
GND [power]: B601.2(NEG) C601.P$2 C603.P$2 C604.P$2 C605.P$2 C606.P$2 C607.P$2 C608.P$2 C610.P$2 C611.P$2 C612.P$2 C613.P$2 C614.P$2 C615.P$2 C616.P$2 C617.P$2 C618.P$2 C619.P$2 C620.P$2 L603.P$3 L603.P$4 L603.P$5 L604.P$3 L604.P$4 L604.P$5 R610.2 R611.1 R615.1 R616.1 R617.1 R621.1 S601.B3 U101.10(VSS) U101.20(BAT:VSSA) U101.27(VSS) U101.74(VSS) U101.99(VSS) U601.2(VSS) U601.6(VBAT) U601.GND(VSS) U601.P$2(VSS) U601.P$3(VSS) U602.2(VSS) U602.6(VBAT) U602.GND(VSS) U602.P$2(VSS) U602.P$3(VSS) U603.1(GND(ADJ)) U604.1(GND(ADJ)) ; also sheet 1,2,3,4,5,7,8,9,10
N$8: C613.P$1 U101.73(VCAP_2)
N$12: C611.P$1 U101.49(VCAP_1)
N$21: D601.C R608.2
N$29: C619.P$1 C620.P$1 L604.P$2 U604.3(VIN)
N$34: R616.2 U602.7(ILIM)
N$96: R617.2 U601.7(ILIM)
VBAT: B601.1(POS) R608.1 U101.6(BAT:VBAT) ; also sheet 7
VDD_3V3_SENSORS [power]: C603.P$1 C604.P$1 C616.P$1 R621.2 U603.2(VOUT) U603.4(VOUT) ; also sheet 5,10
VDD_5V_HIPOWER [power]: C614.P$1 U601.8(OUT) ; also sheet 2
VDD_5V_IN [power]: L603.P$1 L604.P$1 R609.2 U601.1(IN) U602.1(IN) ; also sheet 2,3,8,9,10
VDD_5V_PERIPH [power]: C618.P$1 U602.8(OUT) ; also sheet 2,4
VDD_5V_SENS: R609.1 R610.1 ; also sheet 1

### Notes on the sheet
- Note: Maximise copper area connected 
  to center ground pad.
- Note: Do not populate R603 and R635.  
  Only one may be populated at a time.
- Bypass caps as close to device pins as possible.
- Note: Do not populate R635.
- Current Limits:
  I(limit) = 25000 / R(ilim)
  25K = 1A, 16K5 = 1.5A
- Drain resistor for 
  Sensor Power Rail
- FMU Power and Reset

## Sheet 7 of 10
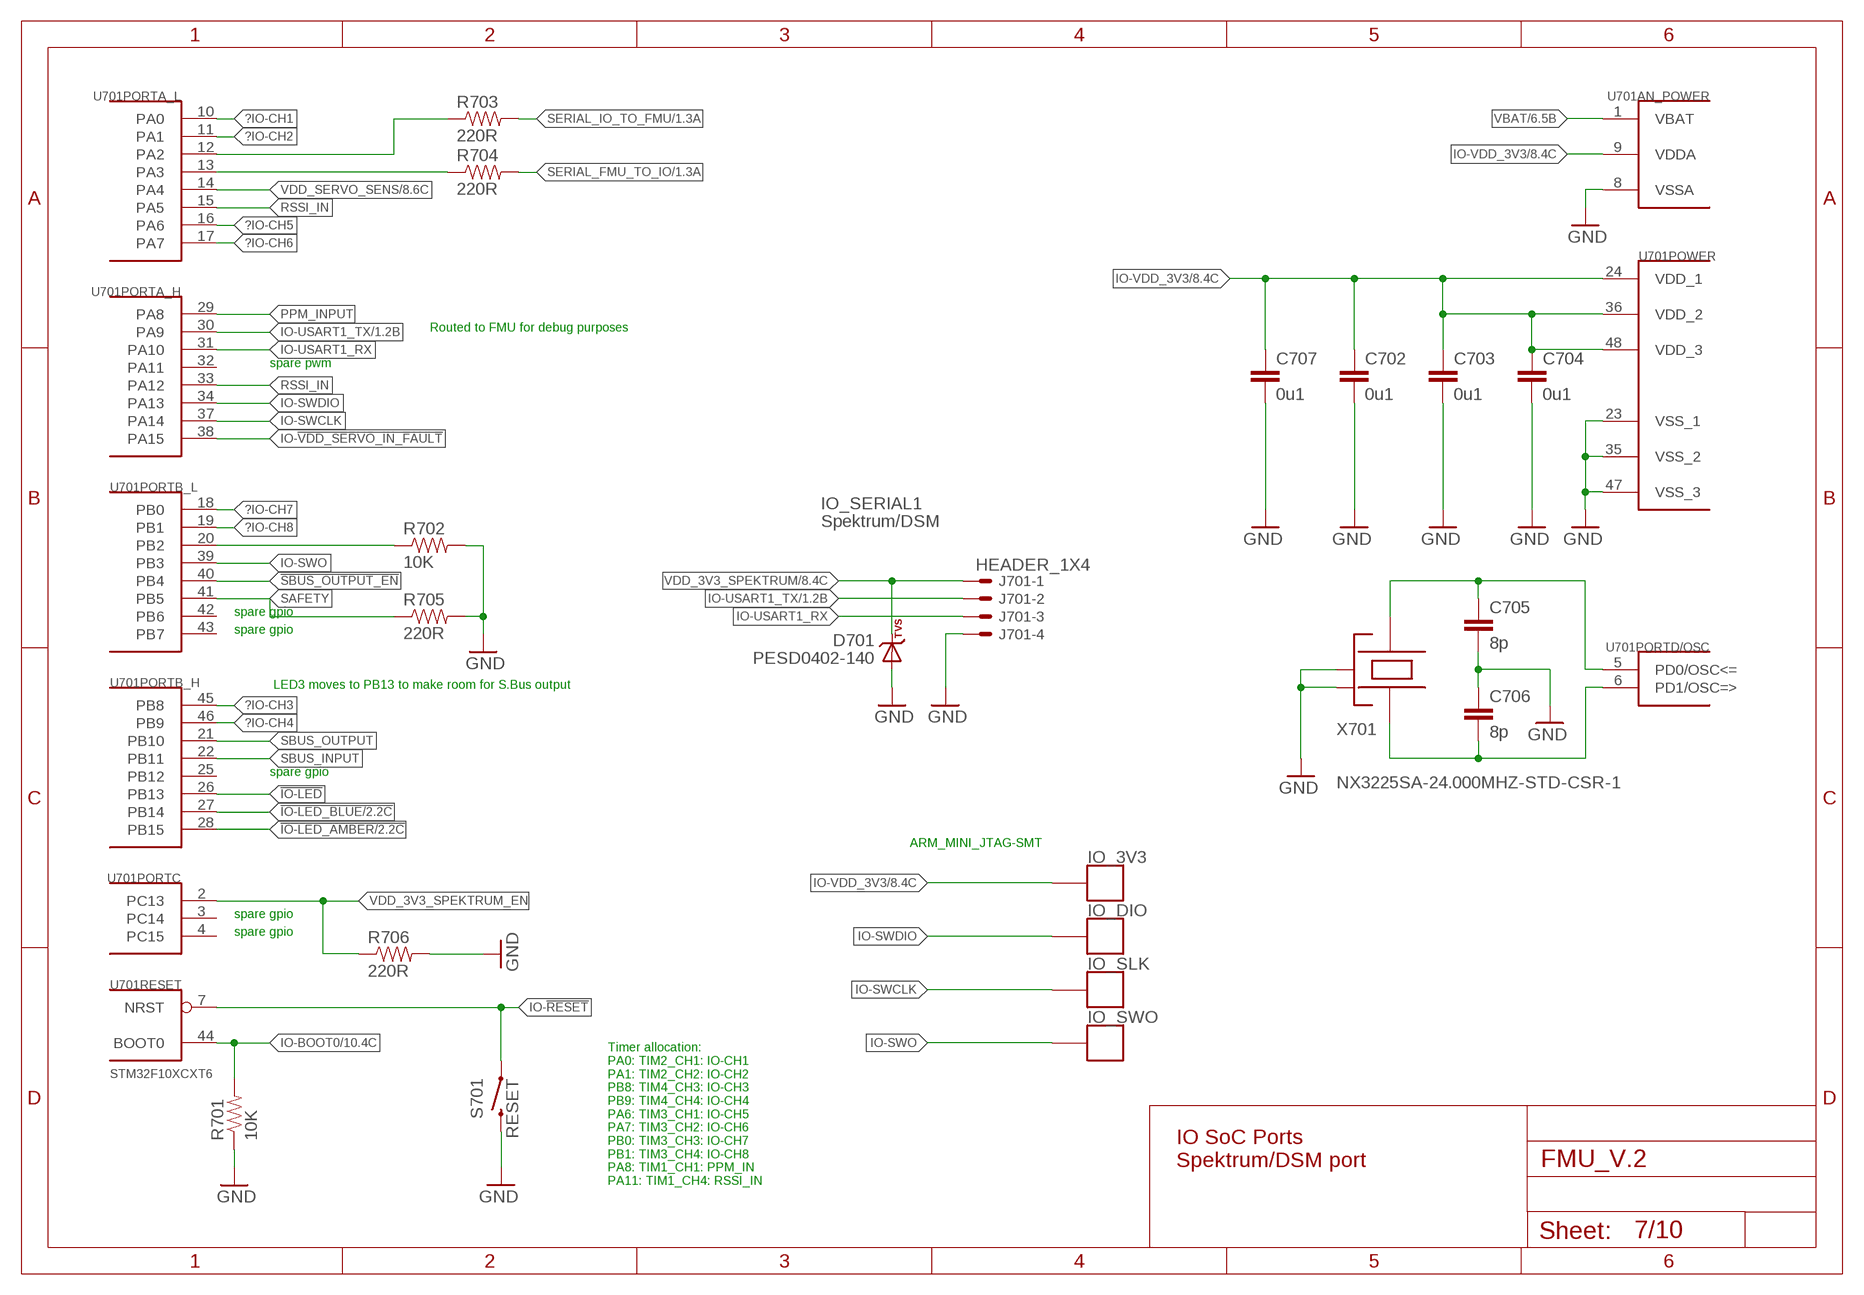
[diagram p6: schematic, sheet 7]

### Parts
C702  0u1  CAP0603  [0603-CAP]
C703  0u1  CAP0603  [0603-CAP]
C704  0u1  CAP0603  [0603-CAP]
C705  8p  CAP0603  [0603-CAP]
C706  8p  CAP0603  [0603-CAP]
C707  0u1  CAP0603  [0603-CAP]
D701  PESD0402-140  DIODE-TVS  [0402-TVS]
IO_3V3  PAD.04  [PAD.04X.04]
IO_DIO  PAD.04  [PAD.04X.04]
IO_SLK  PAD.04  [PAD.04X.04]
IO_SWO  PAD.04  [PAD.04X.04]
J701  HEADER_1X4  [HEADER_2.54MM-1X04]
R701  10K  RESISTOR0603-RES  [0603-RES]
R702  10K  RESISTOR0603-RES  [0603-RES]
R703  220R  RESISTOR0603-RES  [0603-RES]
R704  220R  RESISTOR0603-RES  [0603-RES]
R705  220R  RESISTOR0603-RES  [0603-RES]
R706  220R  RESISTOR0603-RES  [0603-RES]
S701  RESET  SWITCH-MOMENTARY-2  [EVQP7J01K]
U701  STM32F10XCXT6  [TQFP48]
X701  NX3225SA-24.000MHZ-STD-CSR-1  OSCILLATOR-3.2X2.5  [OSCILLATOR-3.2X2.5]

### Nets
!IO-LED: U701.26(PORTB_H:PB13)
!IO-LED_AMBER: U701.28(PORTB_H:PB15) ; also sheet 2
!IO-LED_BLUE: U701.27(PORTB_H:PB14) ; also sheet 2
!SBUS_OUTPUT_EN: U701.40(PORTB_L:PB4)
?IO-CH1: U701.10(PORTA_L:PA0)
?IO-CH2: U701.11(PORTA_L:PA1)
?IO-CH3: U701.45(PORTB_H:PB8)
?IO-CH4: U701.46(PORTB_H:PB9)
?IO-CH5: U701.16(PORTA_L:PA6)
?IO-CH6: U701.17(PORTA_L:PA7)
?IO-CH7: U701.18(PORTB_L:PB0)
?IO-CH8: U701.19(PORTB_L:PB1)
GND [power]: C702.P$2 C703.P$2 C704.P$2 C705.P$2 C706.P$1 C707.P$2 D701.A J701.4 R701.1 R702.2 R705.2 R706.2 S701.B3 U701.8(AN_POWER:VSSA) U701.23(POWER:VSS_1) U701.35(POWER:VSS_2) U701.47(POWER:VSS_3) X701.2(NC_2) X701.4(NC_4) ; also sheet 1,2,3,4,5,6,8,9,10
IO-!RESET: S701.A1 U701.7(RESET:NRST)
IO-!VDD_SERVO_IN_FAULT: U701.38(PORTA_H:PA15)
IO-BOOT0: R701.2 U701.44(RESET:BOOT0) ; also sheet 10
IO-BOOT1: R702.1 U701.20(PORTB_L:PB2)
IO-SWCLK: IO_SLK.P$1 U701.37(PORTA_H:PA14)
IO-SWDIO: IO_DIO.P$1 U701.34(PORTA_H:PA13)
IO-SWO: IO_SWO.P$1 U701.39(PORTB_L:PB3)
IO-USART1_RX: J701.3 U701.31(PORTA_H:PA10)
IO-USART1_TX: J701.2 U701.30(PORTA_H:PA9) ; also sheet 1
IO-VDD_3V3 [power]: C702.P$1 C703.P$1 C704.P$1 C707.P$1 IO_3V3.P$1 U701.9(AN_POWER:VDDA) U701.24(POWER:VDD_1) U701.36(POWER:VDD_2) U701.48(POWER:VDD_3) ; also sheet 4,8
N$11: R704.1 U701.13(PORTA_L:PA3)
N$15: R703.1 U701.12(PORTA_L:PA2)
N$18: C706.P$2 U701.6(PORTD/OSC:PD1/OSC=>) X701.1
N$22: C705.P$1 U701.5(PORTD/OSC:PD0/OSC<=) X701.3
PPM_INPUT: U701.29(PORTA_H:PA8)
RSSI_IN: U701.15(PORTA_L:PA5) U701.33(PORTA_H:PA12)
SAFETY: R705.1 U701.41(PORTB_L:PB5)
SBUS_INPUT: U701.22(PORTB_H:PB11)
SBUS_OUTPUT: U701.21(PORTB_H:PB10)
SERIAL_FMU_TO_IO: R704.2 ; also sheet 1
SERIAL_IO_TO_FMU: R703.2 ; also sheet 1
VBAT: U701.1(AN_POWER:VBAT) ; also sheet 6
VDD_3V3_SPEKTRUM [power]: D701.C J701.1 ; also sheet 8
VDD_3V3_SPEKTRUM_EN: R706.1 U701.2(PORTC:PC13)
VDD_SERVO_SENS: U701.14(PORTA_L:PA4) ; also sheet 8
Unconnected: U701.3(PORTC:PC14) U701.4(PORTC:PC15) U701.25(PORTB_H:PB12) U701.32(PORTA_H:PA11) U701.42(PORTB_L:PB6) U701.43(PORTB_L:PB7)

### Notes on the sheet
- Routed to FMU for debug purposes
- spare pwm
- IO_SERIAL1
- Spektrum/DSM
- spare gpio
- spare gpio
- LED3 moves to PB13 to make room for S.Bus output
- spare gpio
- ARM_MINI_JTAG-SMT
- spare gpio
- spare gpio
- IO SoC Ports
  Spektrum/DSM port
- Timer allocation:
  PA0: TIM2_CH1: IO-CH1
  PA1: TIM2_CH2: IO-CH2
  PB8: TIM4_CH3: IO-CH3
  PB9: TIM4_CH4: IO-CH4
  PA6: TIM3_CH1: IO-CH5
  PA7: TIM3_CH2: IO-CH6
  PB0: TIM3_CH3: IO-CH7
  PB1: TIM3_CH4: IO-CH8
  PA8: TIM1_CH1: PPM_IN
  PA11: TIM1_CH4: RSSI_IN

## Sheet 8 of 10
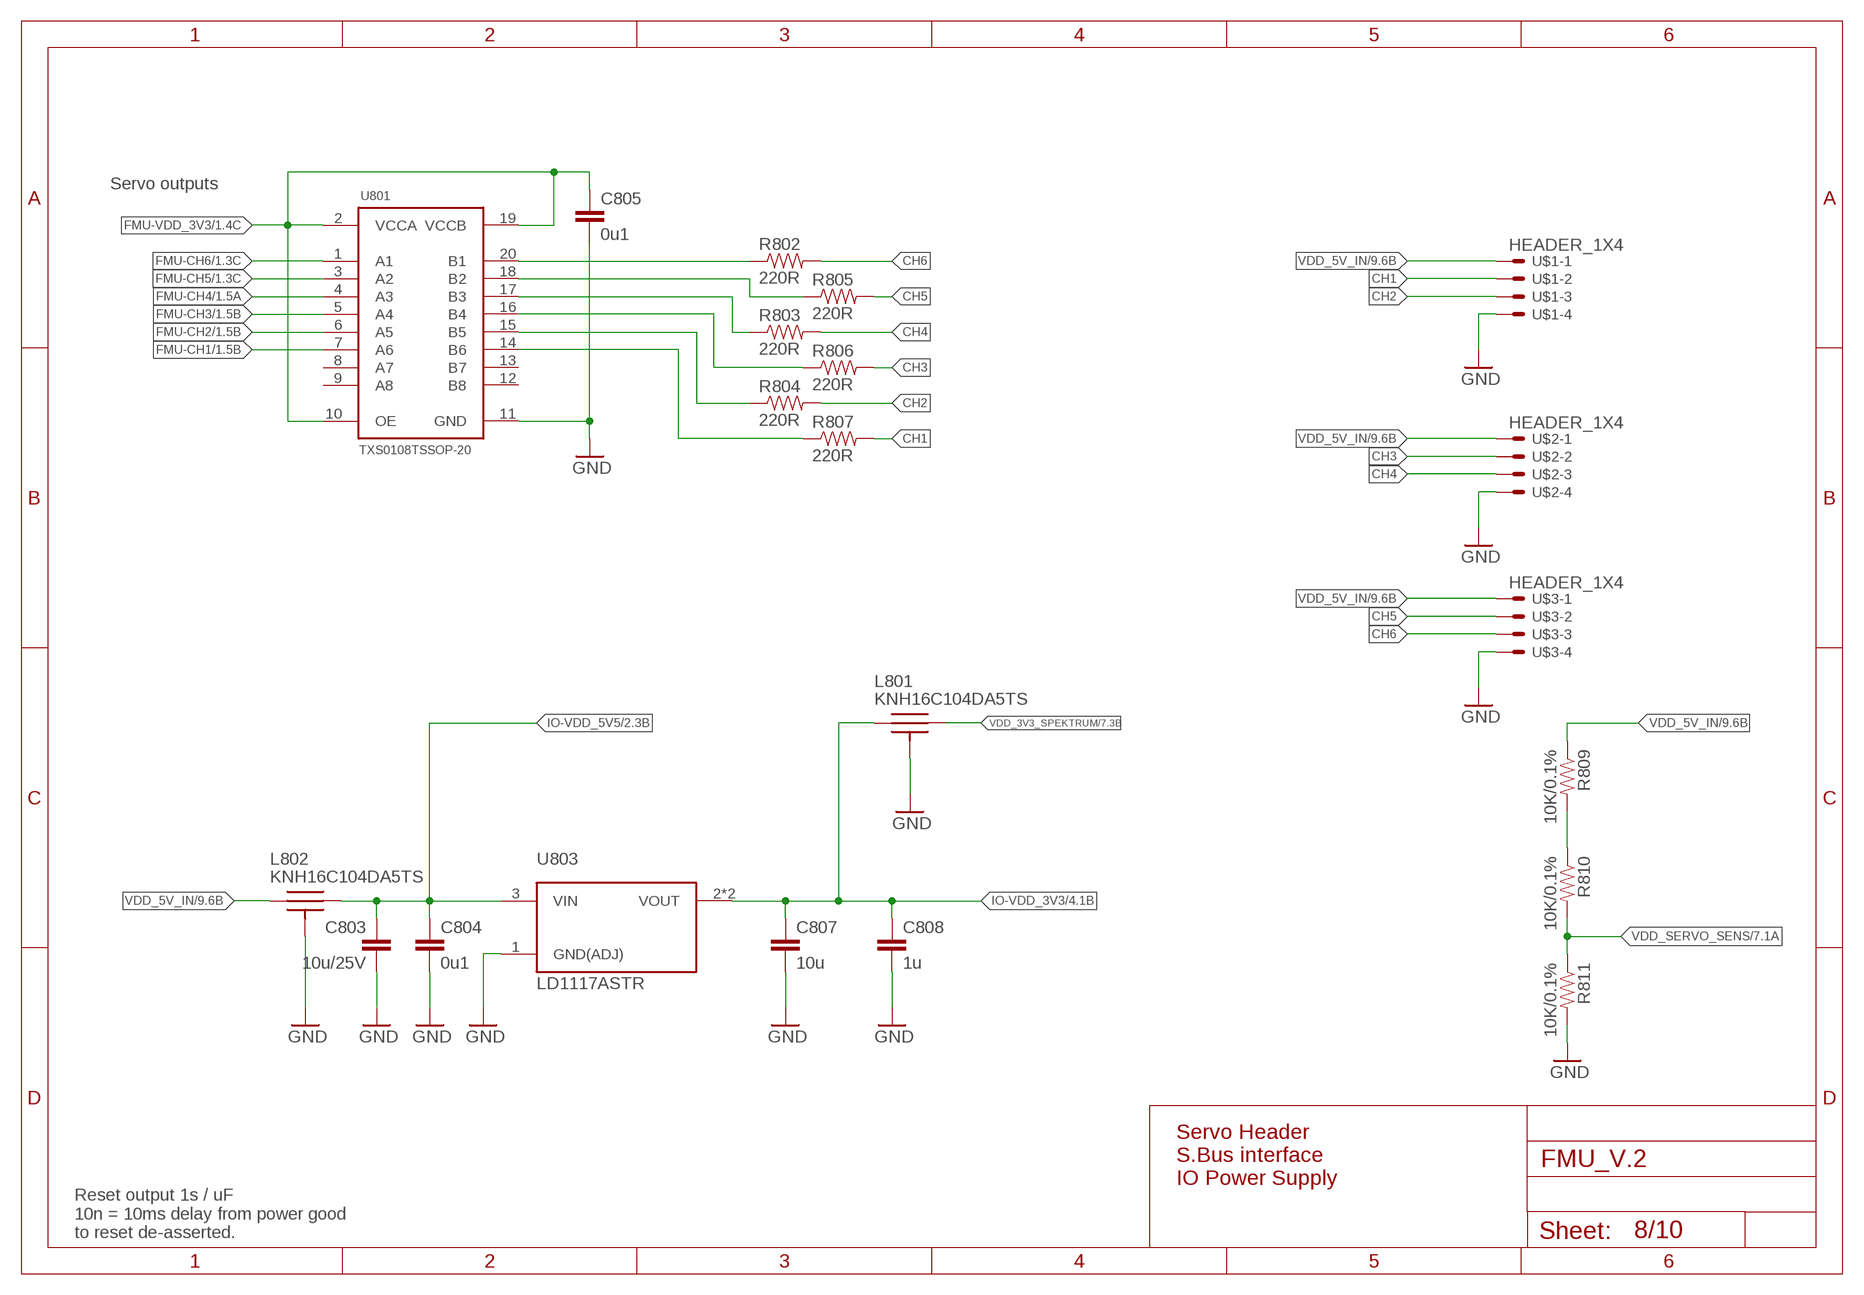
[diagram p7: schematic, sheet 8]

### Parts
C803  10u/25V  CAP0805  [0805-CAP]
C804  0u1  CAP0603  [0603-CAP]
C805  0u1  CAP0603  [0603-CAP]
C807  10u  CAP0603  [0603-CAP]
C808  1u  CAP0603  [0603-CAP]
L801  KNH16C104DA5TS  [KYOCERA-KNH16-DA]
L802  KNH16C104DA5TS  [KYOCERA-KNH16-DA]
R802  220R  RESISTOR0603-RES  [0603-RES]
R803  220R  RESISTOR0603-RES  [0603-RES]
R804  220R  RESISTOR0603-RES  [0603-RES]
R805  220R  RESISTOR0603-RES  [0603-RES]
R806  220R  RESISTOR0603-RES  [0603-RES]
R807  220R  RESISTOR0603-RES  [0603-RES]
R809  10K/0.1%  RESISTOR0603-RES  [0603-RES]
R810  10K/0.1%  RESISTOR0603-RES  [0603-RES]
R811  10K/0.1%  RESISTOR0603-RES  [0603-RES]
U801  TXS0108TSSOP-20  [R-PDSO-G20]
U803  LD1117ASTR  [SOT-223]
U$1  HEADER_1X4  [HEADER_2.54MM-1X04]
U$2  HEADER_1X4  [HEADER_2.54MM-1X04]
U$3  HEADER_1X4  [HEADER_2.54MM-1X04]

### Nets
CH1: R807.2 U$1.2
CH2: R804.2 U$1.3
CH3: R806.2 U$2.2
CH4: R803.2 U$2.3
CH5: R805.2 U$3.2
CH6: R802.2 U$3.3
FMU-CH1: U801.7(A6) ; also sheet 1
FMU-CH2: U801.6(A5) ; also sheet 1
FMU-CH3: U801.5(A4) ; also sheet 1
FMU-CH4: U801.4(A3) ; also sheet 1
FMU-CH5: U801.3(A2) ; also sheet 1
FMU-CH6: U801.1(A1) ; also sheet 1
FMU-VDD_3V3 [power]: C805.P$1 U801.2(VCCA) U801.10(OE) U801.19(VCCB) ; also sheet 1,2,3,4,6
GND [power]: C803.P$2 C804.P$2 C805.P$2 C807.P$2 C808.P$2 L801.P$3 L801.P$4 L801.P$5 L802.P$3 L802.P$4 L802.P$5 R811.2 U801.11(GND) U803.1(GND(ADJ)) U$1.4 U$2.4 U$3.4 ; also sheet 1,2,3,4,5,6,7,9,10
IO-VDD_3V3 [power]: C807.P$1 C808.P$1 L801.P$1 U803.2(VOUT) U803.4(VOUT) ; also sheet 4,7
IO-VDD_5V5 [power]: C803.P$1 C804.P$1 L802.P$2 U803.3(VIN) ; also sheet 2
N$3: R809.2 R810.1
N$61: R802.1 U801.20(B1)
N$62: R805.1 U801.18(B2)
N$63: R803.1 U801.17(B3)
N$64: R806.1 U801.16(B4)
N$65: R804.1 U801.15(B5)
N$66: R807.1 U801.14(B6)
VDD_3V3_SPEKTRUM [power]: L801.P$2 ; also sheet 7
VDD_5V_IN [power]: L802.P$1 R809.1 U$1.1 U$2.1 U$3.1 ; also sheet 2,3,6,9,10
VDD_SERVO_SENS: R810.2 R811.1 ; also sheet 7
Unconnected: U801.8(A7) U801.9(A8) U801.12(B8) U801.13(B7)

### Notes on the sheet
- Servo outputs
- Servo Header
  S.Bus interface
  IO Power Supply
- Reset output 1s / uF
  10n = 10ms delay from power good
  to reset de-asserted.

## Sheet 9 of 10
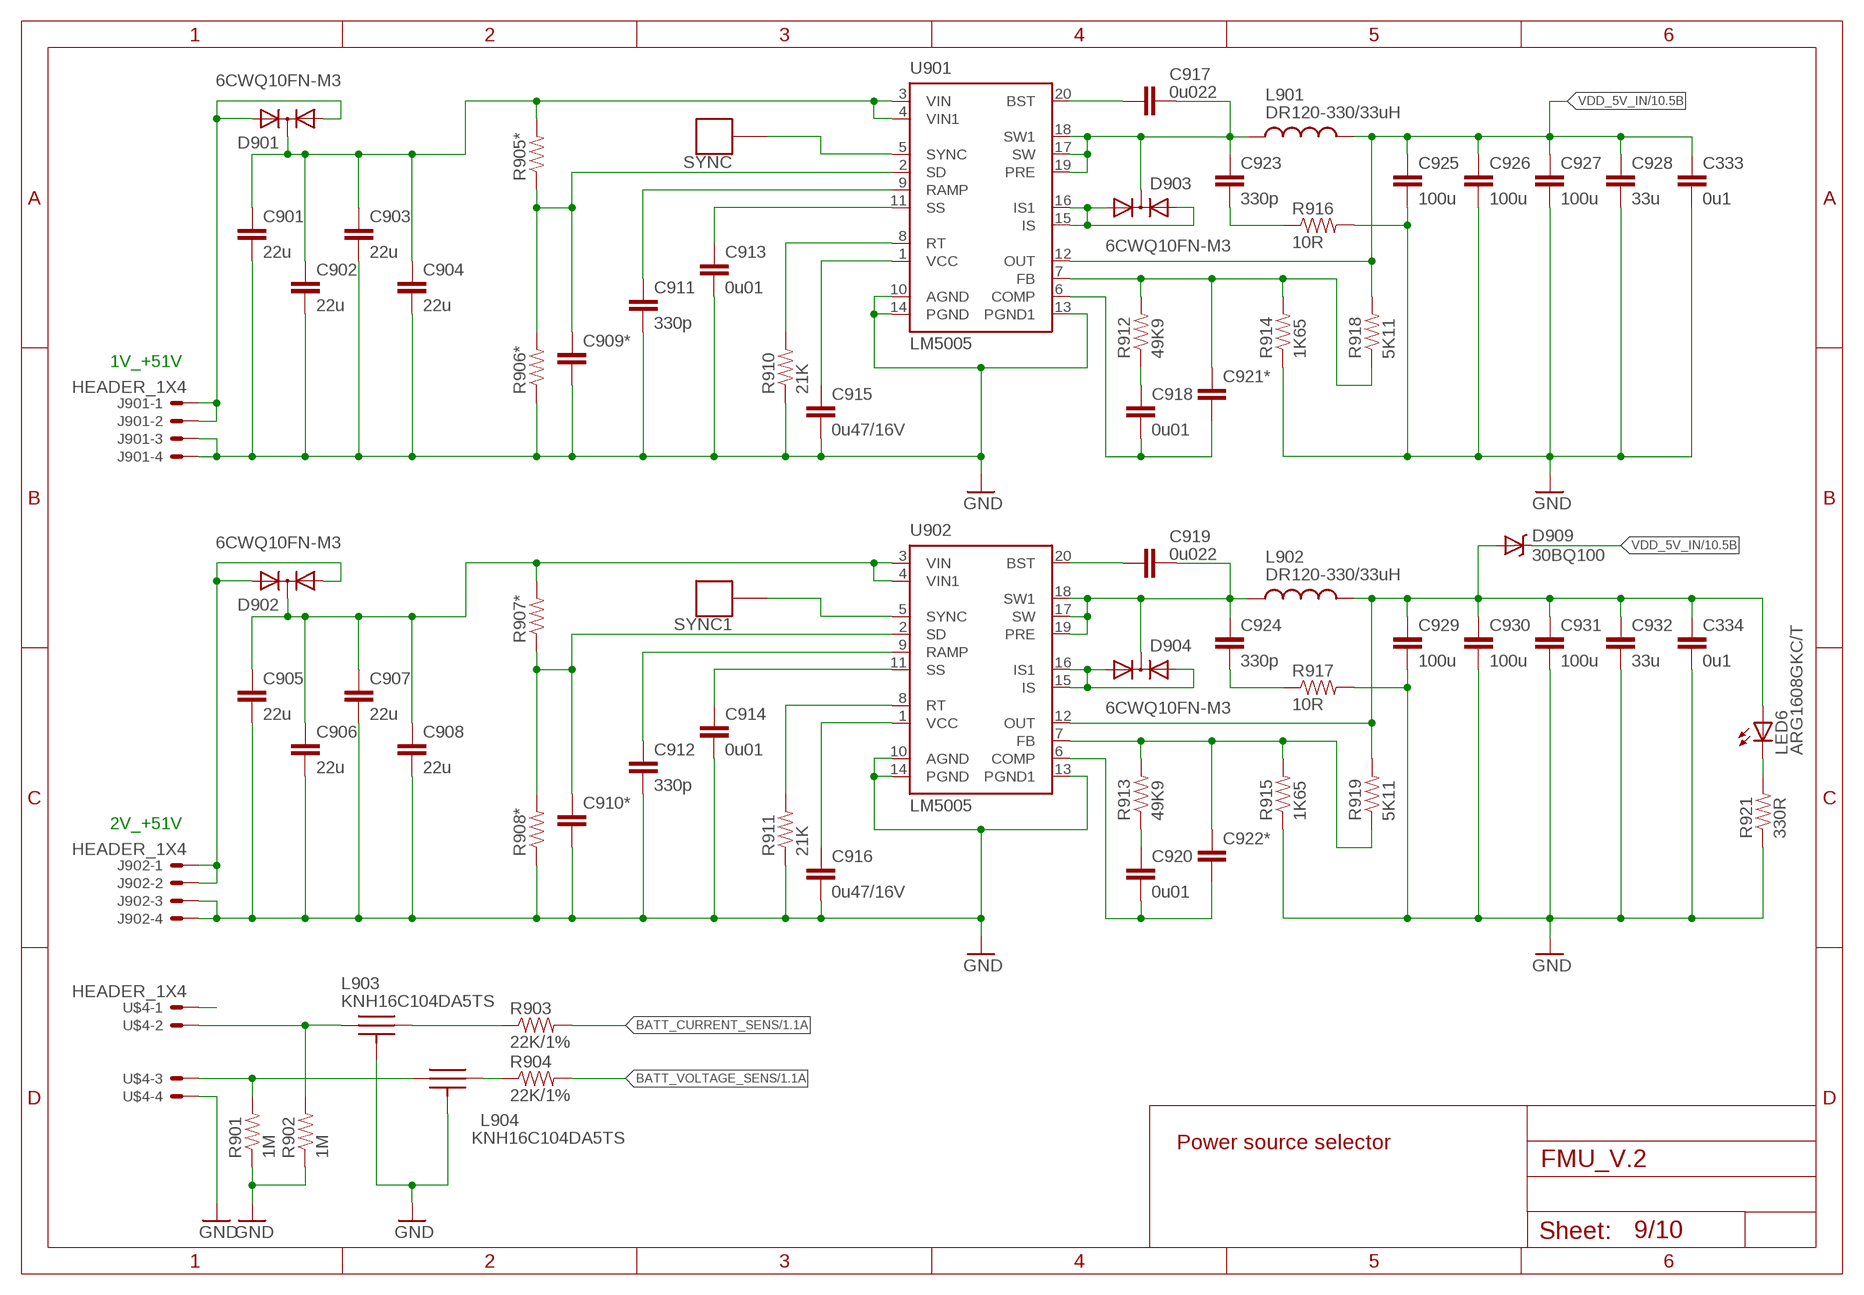
[diagram p8: schematic, sheet 9]

### Parts
C333  0u1  CAP0805  [0805-CAP]
C334  0u1  CAP0805  [0805-CAP]
C901  22u  CAP1812  [1812-CAP]
C902  22u  CAP1812  [1812-CAP]
C903  22u  CAP1812  [1812-CAP]
C904  22u  CAP1812  [1812-CAP]
C905  22u  CAP1812  [1812-CAP]
C906  22u  CAP1812  [1812-CAP]
C907  22u  CAP1812  [1812-CAP]
C908  22u  CAP1812  [1812-CAP]
C909*  CAP0805  [0805-CAP]
C910*  CAP0805  [0805-CAP]
C911  330p  CAP0805  [0805-CAP]
C912  330p  CAP0805  [0805-CAP]
C913  0u01  CAP0805  [0805-CAP]
C914  0u01  CAP0805  [0805-CAP]
C915  0u47/16V  CAP0805  [0805-CAP]
C916  0u47/16V  CAP0805  [0805-CAP]
C917  0u022  CAP0805  [0805-CAP]
C918  0u01  CAP0805  [0805-CAP]
C919  0u022  CAP0805  [0805-CAP]
C920  0u01  CAP0805  [0805-CAP]
C921*  CAP0805  [0805-CAP]
C922*  CAP0805  [0805-CAP]
C923  330p  CAP0805  [0805-CAP]
C924  330p  CAP0805  [0805-CAP]
C925  100u  CAP1206  [1206-CAP]
C926  100u  CAP1206  [1206-CAP]
C927  100u  CAP1206  [1206-CAP]
C928  33u  CAP1206  [1206-CAP]
C929  100u  CAP1206  [1206-CAP]
C930  100u  CAP1206  [1206-CAP]
C931  100u  CAP1206  [1206-CAP]
C932  33u  CAP1206  [1206-CAP]
D901  6CWQ10FN-M3  MOSFET-NCHANNEL-DPAK  [DPAK]
D902  6CWQ10FN-M3  MOSFET-NCHANNEL-DPAK  [DPAK]
D903  6CWQ10FN-M3  MOSFET-NCHANNEL-DPAK  [DPAK]
D904  6CWQ10FN-M3  MOSFET-NCHANNEL-DPAK  [DPAK]
D909  30BQ100  DIODE-SCHOTTKY_SMA  [SMA-DIODE]
J901  HEADER_1X4  [HEADER_2.54MM-1X04]
J902  HEADER_1X4  [HEADER_2.54MM-1X04]
L901  DR120-330/33uH  SLF10145  [SLF10145]
L902  DR120-330/33uH  SLF10145  [SLF10145]
L903  KNH16C104DA5TS  [KYOCERA-KNH16-DA]
L904  KNH16C104DA5TS  [KYOCERA-KNH16-DA]
LED6  ARG1608GKC/T  LED0603  [0603-LED]
R901  1M  RESISTOR0603-RES  [0603-RES]
R902  1M  RESISTOR0603-RES  [0603-RES]
R903  22K/1%  RESISTOR0603-RES  [0603-RES]
R904  22K/1%  RESISTOR0603-RES  [0603-RES]
R905*  RESISTOR0805  [0805]
R906*  RESISTOR0805  [0805]
R907*  RESISTOR0805  [0805]
R908*  RESISTOR0805  [0805]
R910  21K  RESISTOR0805  [0805]
R911  21K  RESISTOR0805  [0805]
R912  49K9  RESISTOR0805  [0805]
R913  49K9  RESISTOR0805  [0805]
R914  1K65  RESISTOR0805  [0805]
R915  1K65  RESISTOR0805  [0805]
R916  10R  RESISTOR2512  [R2512]
R917  10R  RESISTOR2512  [R2512]
R918  5K11  RESISTOR0805  [0805]
R919  5K11  RESISTOR0805  [0805]
R921  330R  RESISTOR0603-RES  [0603-RES]
SYNC  PAD.03  [PAD.03X.03]
SYNC1  PAD.03  [PAD.03X.03]
U901  LM5005  [TSSOP20]
U902  LM5005  [TSSOP20]
U$4  HEADER_1X4  [HEADER_2.54MM-1X04]

### Nets
BATT_CURRENT_SENS: R903.2 ; also sheet 1
BATT_VOLTAGE_SENS: R904.2 ; also sheet 1
CURRENT: L903.P$1 R902.2 U$4.2
GND [power]: C333.P$2 C334.P$2 C901.2 C902.2 C903.2 C904.2 C905.2 C906.2 C907.2 C908.2 C909*.P$2 C910*.P$2 C911.P$2 C912.P$2 C913.P$2 C914.P$2 C915.P$2 C916.P$2 C925.P$2 C926.P$2 C927.P$2 C928.P$2 C929.P$2 C930.P$2 C931.P$2 C932.P$2 J901.3 J901.4 J902.3 J902.4 L903.P$3 L903.P$4 L903.P$5 L904.P$3 L904.P$4 L904.P$5 R901.1 R902.1 R906*.1 R908*.1 R910.1 R911.1 R914.1 R915.1 R916.2 R917.2 R921.1 U901.10(AGND) U901.13(PGND1) U901.14(PGND) U902.10(AGND) U902.13(PGND1) U902.14(PGND) U$4.4 ; also sheet 1,2,3,4,5,6,7,8,10
N$27: C918.P$1 R912.1
N$30: LED6.C R921.2
N$39: C920.P$1 R913.1
N$41: U$4.1
N$47: C911.P$1 U901.9(RAMP)
N$52: D903.1(A1) D903.3(A2) U901.15(IS) U901.16(IS1)
N$54: SYNC.P$1 U901.5(SYNC)
N$55: C909*.P$1 R905*.1 R906*.2 U901.2(SD)
N$56: C913.P$1 U901.11(SS)
N$67: D901.1(A1) D901.3(A2) J901.1 J901.2
N$69: C901.1 C902.1 C903.1 C904.1 D901.4(C) R905*.2 U901.3(VIN) U901.4(VIN1)
N$71: C334.P$1 C929.P$1 C930.P$1 C931.P$1 C932.P$1 D909.A L902.P$2 LED6.A R919.2 U902.12(OUT)
N$76 [power]: C917.P$2 C923.P$1 D903.4(C) L901.P$1 U901.17(SW) U901.18(SW1) U901.19(PRE)
N$97: C915.P$1 U901.1(VCC)
N$102: L904.P$2 R904.1
N$103: L903.P$2 R903.1
N$105: C905.1 C906.1 C907.1 C908.1 D902.4(C) R907*.2 U902.3(VIN) U902.4(VIN1)
N$106: R910.2 U901.8(RT)
N$107: C917.P$1 U901.20(BST)
N$108: C923.P$2 R916.1
N$111: C916.P$1 U902.1(VCC)
N$112: C921*.P$1 R912.2 R914.2 R918.1 U901.7(FB)
N$113: C918.P$2 C921*.P$2 U901.6(COMP)
N$116: R911.2 U902.8(RT)
N$117: C914.P$1 U902.11(SS)
N$118: C912.P$1 U902.9(RAMP)
N$119: SYNC1.P$1 U902.5(SYNC)
N$120: C910*.P$1 R907*.1 R908*.2 U902.2(SD)
N$121: D902.1(A1) D902.3(A2) J902.1 J902.2
N$122: D904.1(A1) D904.3(A2) U902.15(IS) U902.16(IS1)
N$123: C919.P$2 C924.P$1 D904.4(C) L902.P$1 U902.17(SW) U902.18(SW1) U902.19(PRE)
N$124: C919.P$1 U902.20(BST)
N$125: C924.P$2 R917.1
N$126: C922*.P$1 R913.2 R915.2 R919.1 U902.7(FB)
N$127: C920.P$2 C922*.P$2 U902.6(COMP)
VDD_5V_IN [power]: C333.P$1 C925.P$1 C926.P$1 C927.P$1 C928.P$1 D909.C L901.P$2 R918.2 U901.12(OUT) ; also sheet 2,3,6,8,10
VOLTAGE: L904.P$1 R901.2 U$4.3

### Notes on the sheet
- 1V_+51V
- 2V_+51V
- Power source selector

## Sheet 10 of 10
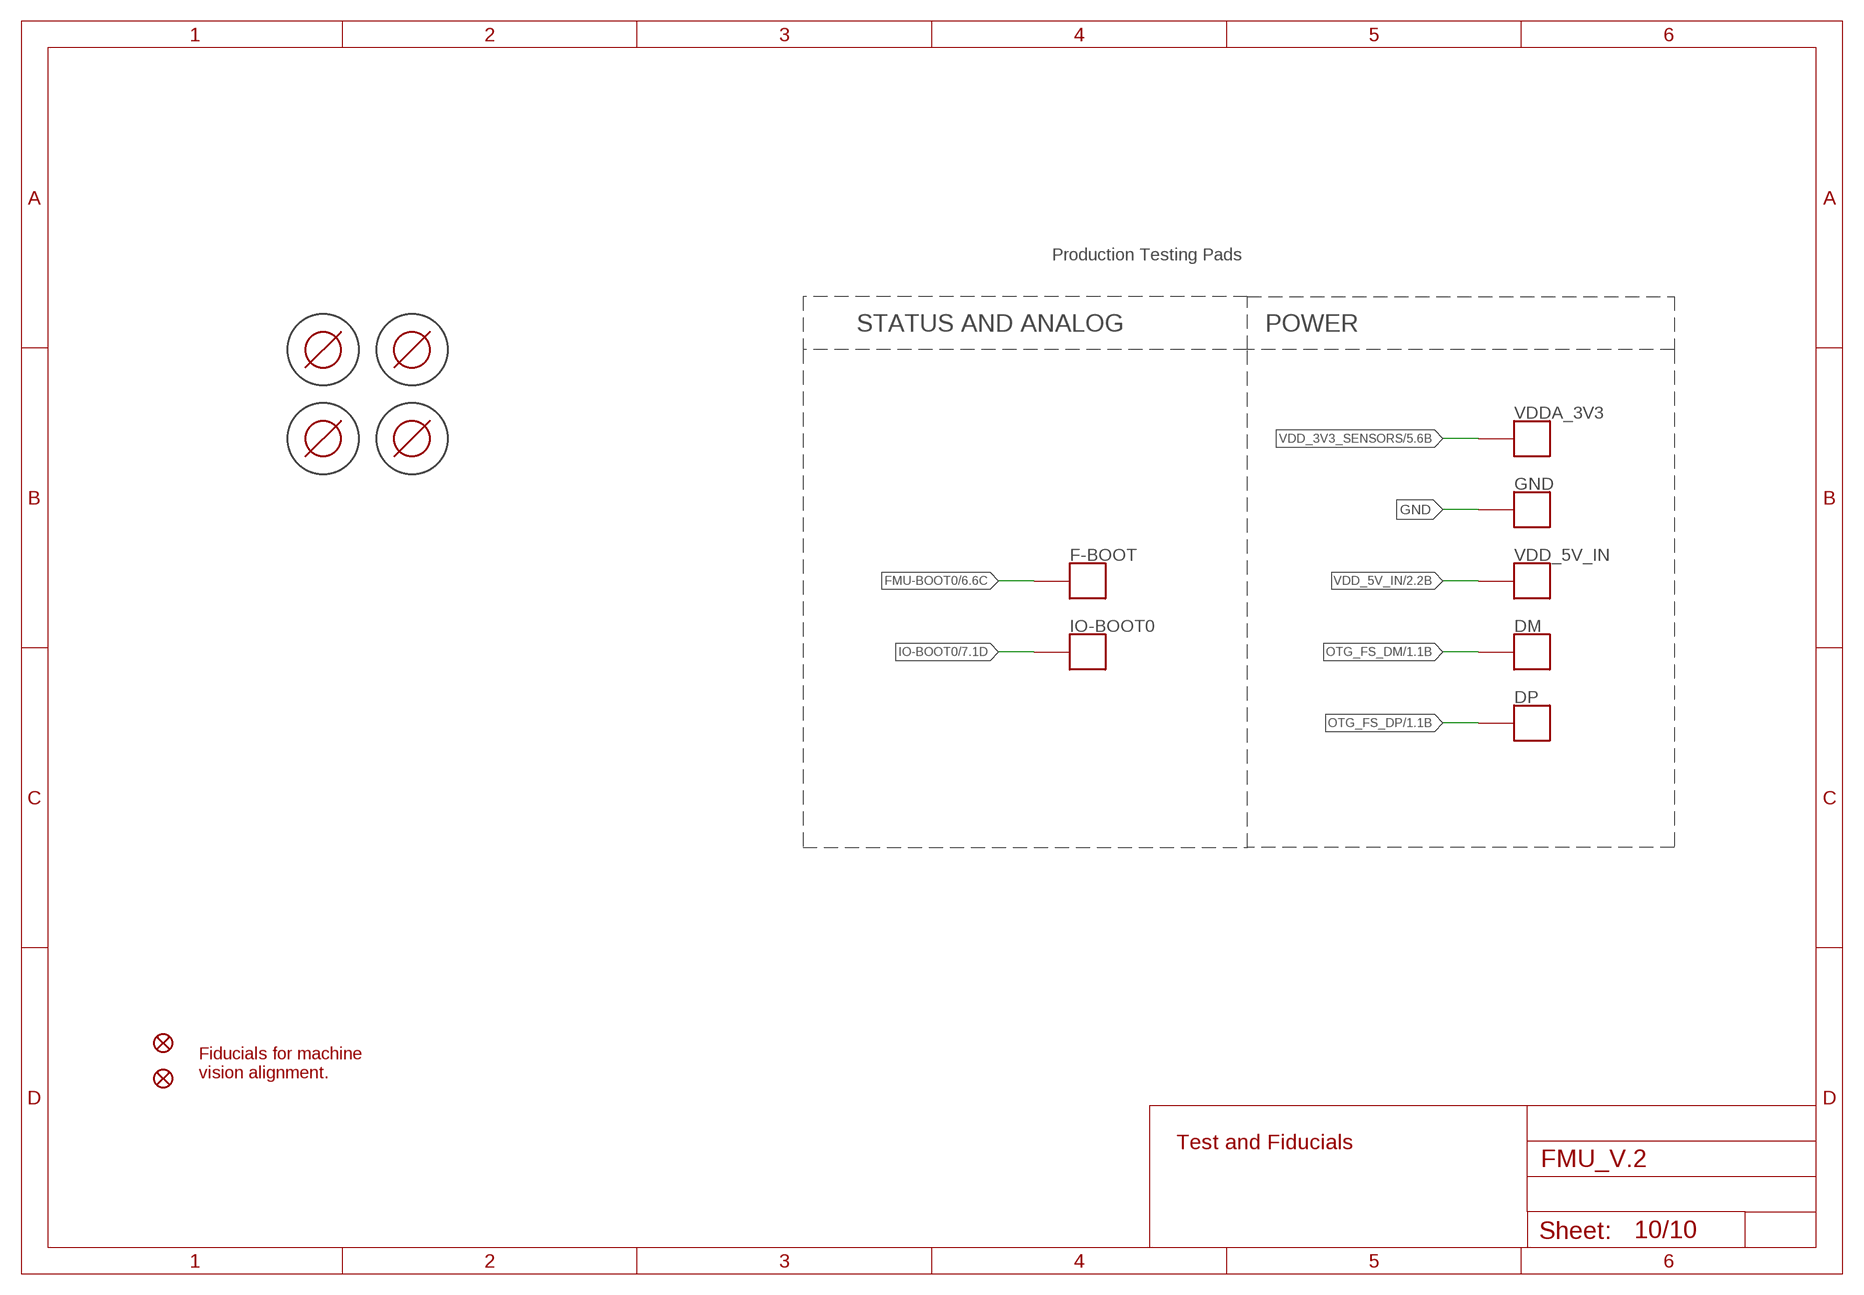
[diagram p9: schematic, sheet 10]

### Parts
DM  PAD.04  [PAD.04X.04]
DP  OTG_FS_DP  PAD.04  [PAD.04X.04]
F-BOOT  PAD.04  [PAD.04X.04]
GND  PAD.04  [PAD.04X.04]
IO-BOOT0  PAD.04  [PAD.04X.04]
JP3  FIDUCIAL1.5X3  [FIDUCIAL-1.5X3]
JP4  FIDUCIAL1.5X3  [FIDUCIAL-1.5X3]
M3_MOUNT1  MOUNT-HOLE3.1MM  [MOUNT-HOLE3.1]
M3_MOUNT2  MOUNT-HOLE3.1MM  [MOUNT-HOLE3.1]
M3_MOUNT3  MOUNT-HOLE3.1MM  [MOUNT-HOLE3.1]
M3_MOUNT4  MOUNT-HOLE3.1MM  [MOUNT-HOLE3.1]
VDD_5V_IN  PAD.04  [PAD.04X.04]
VDDA_3V3  PAD.04  [PAD.04X.04]

### Nets
FMU-BOOT0: F-BOOT.P$1 ; also sheet 6
GND [power]: GND.P$1 ; also sheet 1,2,3,4,5,6,7,8,9
IO-BOOT0: IO-BOOT0.P$1 ; also sheet 7
OTG_FS_DM: DM.P$1 ; also sheet 1,3
OTG_FS_DP: DP.P$1 ; also sheet 1,3
VDD_3V3_SENSORS [power]: VDDA_3V3.P$1 ; also sheet 5,6
VDD_5V_IN [power]: VDD_5V_IN.P$1 ; also sheet 2,3,6,8,9

### Notes on the sheet
- Production Testing Pads
- STATUS AND ANALOG | POWER
- Fiducials for machine
  vision alignment.
- Test and Fiducials

## Library data of the parts
+5 +5V +12V +32V = pinhead:PINHD-1X1: PIN HEADER
ACCEL_D ACSEL_M F-CLK F-DIO F-SWO F-VDD_3V3 GIRO_CS GIRO_D GPIO GPIO_A_M IO_3V3 IO_DIO IO_SLK IO_SWO MAG_D MISO MOSI NSS S_MISO S_MOSI S_SCK SCK SYNC SYNC1 = pixhawk2:PAD: Test pad This footprint includes three classes: The actual test pads, a pogo-pin footprint to mount the pogo-pin as through-hole part and a hole footprint which allows the head of the pogo-pin to pass through (do NOT use the hole to mount the pogo-pin). In a typical test setup, the stack would consist of three PCBs: The actual PCB under testing with a test pad on the bottom, then a second PCB with the hole for the pogo-pin head where the PCB under testing is pressed on and a third PCB at 30 mm / 1.2" distance with the pogo-pin footprints. The pogo-pins are soldered to the last PCB. To create the stack, copy the board under testing and exchange the footprints - this way the correct positioning is ensured.
B601 = pixhawk2:MS621FE: SEIKO 6.8mm Rechargeable 3V lithium battery If discontinued or not available, similar devices are available from Panasonic and Sanyo, usually direct replacements.; DATASHEET: http://speed.sii.co.jp/data/file_PRODUCT_MASTER_50112_TITLE_IMAGESP.pdf; LINK: http://search.digikey.com/us/en/products/MS621FE-FL11E/728-1057-ND/1889208; MFGPN: MS621FE; PARTNO: MS621FE-FL11E
C101-C103 C201-C204 C301-C309 C312 C313 C401-C411 C503 C507-C509 C514 C516 C606-C608 C610 C612 C615-C617 C619 C702-C707 C803-C805 C807 C808 = pixhawk2:CAP: Capacitor Standard 0603 ceramic capacitor, and 0.1" leaded capacitor.
C310 C311 = pixhawk2:CAP_POL: Capacitor Polarized These are standard SMD and PTH capacitors. Normally 10uF, 47uF, and 100uF in electrolytic and tantalum varieties. Always verify the external diameter of the through hole cap, it varies with capacity, voltage, and manufacturer. The EIA devices should be standard.
C333 C334 C901-C908 C909* C910* C911-C920 C921* C922* C923-C932 = hc104-pix:CAP: Capacitor Standard 0603 ceramic capacitor, and 0.1" leaded capacitor.
C506 C511 = pixhawk2:CAP: Capacitor Standard 0603 ceramic capacitor, and 0.1" leaded capacitor.; PARTNO: CC0805ZKY5V6BB106
C512 C513 C611 C613 = pixhawk2:CAP: Capacitor Standard 0603 ceramic capacitor, and 0.1" leaded capacitor.; PARTNO: C1608X6S1C225K080AC
C515 = pixhawk2:CAP: Capacitor Standard 0603 ceramic capacitor, and 0.1" leaded capacitor.; PARTNO: 06033C103JAT2A
C601 C620 = pixhawk2:CAP: Capacitor Standard 0603 ceramic capacitor, and 0.1" leaded capacitor.; PARTNO: CL21A106KAYNNNE
C603 = pixhawk2:CAP: Capacitor Standard 0603 ceramic capacitor, and 0.1" leaded capacitor.; PARTNO: CC0603ZRY5V7BB105
C604 C605 = pixhawk2:CAP: Capacitor Standard 0603 ceramic capacitor, and 0.1" leaded capacitor.; PARTNO: CL21A226MAQNNNE
C614 C618 = pixhawk2:CAP: Capacitor Standard 0603 ceramic capacitor, and 0.1" leaded capacitor.; PARTNO: C3216X5R1A107M160AC
D201-D203 D401 D403 D701 = pixhawk2:DIODE-TVS; PARTNO: PESD0402-140
D301 D404 D405 = diode:PESD1CAN: CAN bus ESD protection diode Source: http://www.nxp.com/documents/data_sheet/PESD1CAN.pdf
D302 = fmu2:DIODE-SCHOTTKY: Schottky barrier diode in DO214AC, e.g. Fairchild SS14.
D601 D909 = pixhawk2:DIODE-SCHOTTKY: Schottky barrier diode in DO214AC, e.g. Fairchild SS14.
D901-D904 = pixhawk2:MOSFET-NCHANNEL
DM DP F-BOOT GND IO-BOOT0 VDD_5V_IN VDDA_3V3 = pixhawk2:PAD: Test pad This footprint includes three classes: The actual test pads, a pogo-pin footprint to mount the pogo-pin as through-hole part and a hole footprint which allows the head of the pogo-pin to pass through (do NOT use the hole to mount the pogo-pin). In a typical test setup, the stack would consist of three PCBs: The actual PCB under testing with a test pad on the bottom, then a second PCB with the hole for the pogo-pin head where the PCB under testing is pressed on and a third PCB at 30 mm / 1.2" distance with the pogo-pin footprints. The pogo-pins are soldered to the last PCB. To create the stack, copy the board under testing and exchange the footprints - this way the correct positioning is ensured.; BOM: EXCLUDE; PARTNO: *
J201-J204 J301-J303 J401-J404 J701 J901 J902 U$1-U$4 = pixhawk2:HEADER_1X4
JP3 JP4 = pixhawk2:FIDUCIAL: Fiducial Alignment Points Various fiducial points for machine vision alignment.
L201-L203 L401 L404 L603 L604 L903 L904 = pixhawk2:KNH16C104DA5TS: Kyocera KNH16C104DA5TS EMI filter; PARTNO: KNH16C104DA5TS
L204 = pixhawk2:INDUCTOR: Inductors Basic Inductor/Choke - 0603 and 1210. Footprints are not proven and vary greatly between part numbers. SRR1210: Bourns SRR1210 parts, e.g. SRR1210-100M
L801 L802 = pixhawk2:KNH16C104DA5TS: Kyocera KNH16C104DA5TS EMI filter
L901 L902 = SLF10145:SLF10145: SMD Power Inductor Component Size : Mount Area : 10.1mm x 10.1mm Low Profile : 4.8mm Max. Height
LED1-LED6 = pixhawk2:LED: LEDs Standard schematic elements and footprints for 5mm, 3mm, 1206, and 0603 sized LEDs. 5mm - Spark Fun Electronics SKU : COM-00529 (and others)
M3_MOUNT1-M3_MOUNT4 = pixhawk2:MOUNT-HOLE; BOM: EXCLUDE; PARTNO: *
R101-R104 R201-R218 R301-R307 R309-R312 R401 R402 R404 R405 R407-R412 R602 R604 R608-R611 R615-R617 R621 R701-R706 R802-R807 R809-R811 R921 = pixhawk2:RESISTOR: Resistor Basic schematic elements and footprints for 0603, 1206, and PTH 1/10th watt (small) resistors.
R901-R904 R905* R906* R907* R908* R910-R919 = hc104-pix:RESISTOR: Resistor Basic schematic elements and footprints for 0603, 1206, and PTH 1/10th watt (small) resistors.
S601 S701 = pixhawk2:SWITCH-MOMENTARY-2; PARTNO: EVQ-P7J01P
SJ1-SJ3 = jumper:SJ: SMD solder JUMPER
SJ4 = jumper:SJ2W: SMD solder JUMPER
U101 = pixhawk2:STM32F4X7VX: STM32F4X7VX 100 pin LQFP STM32F407VE - 512 KB flash, no crypto STM32F407VG - 1 MB flash, no crypto STM32F417VE - 512 KB flash, with crypto STM32F417VG - 1 MB flash, with crypto; PARTNO: STM32F427VI
U102 = pixhawk2:FM25V01: FM25V01 128Kb Serial 3V F-RAM Memory; DATASHEET: http://www.ramtron.com/files/datasheets/FM25V01_ds.pdf; LINK: http://www.digikey.com/product-detail/en/FM25V01-GTR/1140-1026-1-ND/2809832; MFGPN: FM25V01; PARTNO: FM25V01-G
U201 U801 = pixhawk2:TXS0108
U202 = pixhawk2:LT3469: LT3469 Piezo microactuator driver with boost regulator
U301 = baseboard:MICROSDSDI; PARTNO: 2908-05WB-MG
U302 = pixhawk2:NUF2042XV6; PARTNO: NUF2042XV6T1G
U303 U401 = analog-devices:ADUM1301: Triple-Channel Digital Isolators Source: http://www.analog.com/static/imported-files/data_sheets/ADuM1300_1301.pdf; MPN: ADUM1301BRWZ; OC_FARNELL: 1465623; OC_NEWARK: 19M0757
U304 = maxim:MAX481CSA: RS485 TRANSEIVER; MF: MAXIM; MPN: MAX481CSA; OC_FARNELL: unknown; OC_NEWARK: 90C3817
U305 = maxim:MAX232ECWE: RS232 TRANSCEIVER; MF: MAXIM; MPN: MAX232ECWE+; OC_FARNELL: 9724435; OC_NEWARK: 67K4440
U402 U403 = pixhawk2:MAX3051: 3.3-V CAN TRANSCEIVER; PARTNO: MAX3051EKA
U502 = ICM20609:ICM20609: ICM20609
U503 = pixhawk2:MPU-9250: MPU-9250 edit this description Auto generated by make-symbol-device-package-bsdl.ulp Rev. 44 Source: MPU-9250.txt
U504 = pixhawk2:MPU-6000: Invensense MPU-6000: 3-axis gyro, 3-axis accel & 9-axis MotionFusion The MPU-60X0 Motion Processing Unit (MPU?) is the world?s first motion processing solution with integrated 9-axis sensor fusion for handset and tablet applications, game controllers, motion pointer remote controls, and other consumer devices. The MPU-60X0 has an embedded 3-axis MEMS gyroscope, 3-axis MEMS accelerometer and Digital Motion Processor? (DMP) hardware accelerator engine with an auxiliary I 2 C port that interfaces to third party digital sensors, such as magnetometers. Interfacing with a 3-axis magnetometer delivers a complete 9-axis sensor fusion output to the MPU?s primary I 2 C or SPI port. (SPI is available on MPU-6000 only). This combines acceleration and rotational motion plus heading information into a single data stream for the application; DATASHEET: http://invensense.com/mems/gyro/documents/PS-MPU-6000A-00_v1.0.pdf; LINK: http://invensense.com/mems/gyro/mpu6000.html; MFGPN: MPU-6000; PARTNO: MPU-6000
U506 = pixhawk2:MS5611-01BA: MS5611-01BA The MS5611-01BA is a new generation of high resolution altimeter sensors from MEAS Switzerland with SPI and I 2 C bus interface. It is optimized for altimeters and variometers with an altitude resolution of 10 cm. The sensor module includes a high linearity pressure sensor and an ultra low power 24 bit ?? ADC with internal factory calibrated coefficients. It provides a precise digital 24 Bit pressure and temperature value and different operation modes that allow the user to optimize for conversion speed and current consumption. A high resolution temperature output allows the implementation of an altimeter/thermometer function without any additional sensor. The MS5611-01BA can be interfaced to virtually any microcontroller. The communication protocol is simple, without the need of programming internal registers in the device. Small dimensions of only 5.0 mm x 3.0 mm and a height of 1.7 mm allow for integration in mobile devices. This new sensor module generation is based on leading MEMS technology and latest benefits from MEAS Switzerland proven experience and know-how in high volume manufacturing of altimeter modules, which have been widely used for over a decade. The sensing principle employed leads to very low hysteresis and high stability of both pressure and temperature signal. High resolution module, 10 cm Fast conversion down to 1 ms Low power, 1 µA (standby < 0.15 µA) QFN package 5.0 x 3.0 x 1.7 mm3 Supply voltage 1.8 to 3.6 V Integrated digital pressure sensor (24 bit ?? ADC) Operating range: 10 to 1200 mbar, -40 to +85 °C I2C and SPI interface up to 20 MHz No external components (Internal oscillator) Excellent long term stability; DATASHEET: http://www.meas-spec.com/downloads/MS5611-01BA01.pdf; LINK: http://www.meas-spec.com/product/t_product.aspx?id=8503#; MFGPN: MS5611-01BA; PARTNO: MS5611-01BA
U601 U602 = pixhawk2:BQ24315; PARTNO: BQ24315DSGR
U603 U604 U803 = pixhawk2:LD1117A: LD1117A LDO Datasheet: http://www.st.com/stonline/books/pdf/docs/7194.pdf
U701 = pixhawk2:STM32F10XCXT6: ST STM32F101/103 48pin LQFP; PARTNO: STM32F100C8T6B
U901 U902 = national-semiconductor:LM5005: High Voltage Monolithic Two-Switch Forward DC-DC Regulator Source: http://cache.national.com/ds/LM/LM5015.pdf; MPN: LM5015MH/NOPB; OC_FARNELL: 1535370; OC_NEWARK: 64M7033
USB1 = pixhawk2:MOLEX-47346-0001: MICRO USB B, BOTTOM MOUNT
X101 X701 = pixhawk2:OSCILLATOR: Crystal Oscillator in 3.2x2.5 SMD; PARTNO: NX3225SA-24.000000MHZ

## Net classes
0 signal: width 0.15 mm, drill 0.15 mm, clearance 0.152 mm
1 power: width 0.15 mm, drill 0.2 mm, clearance 0.152 mm